# EAGLE design SSTuino_II (EAGLE 9.6.2)

## Sheet 1 of 3
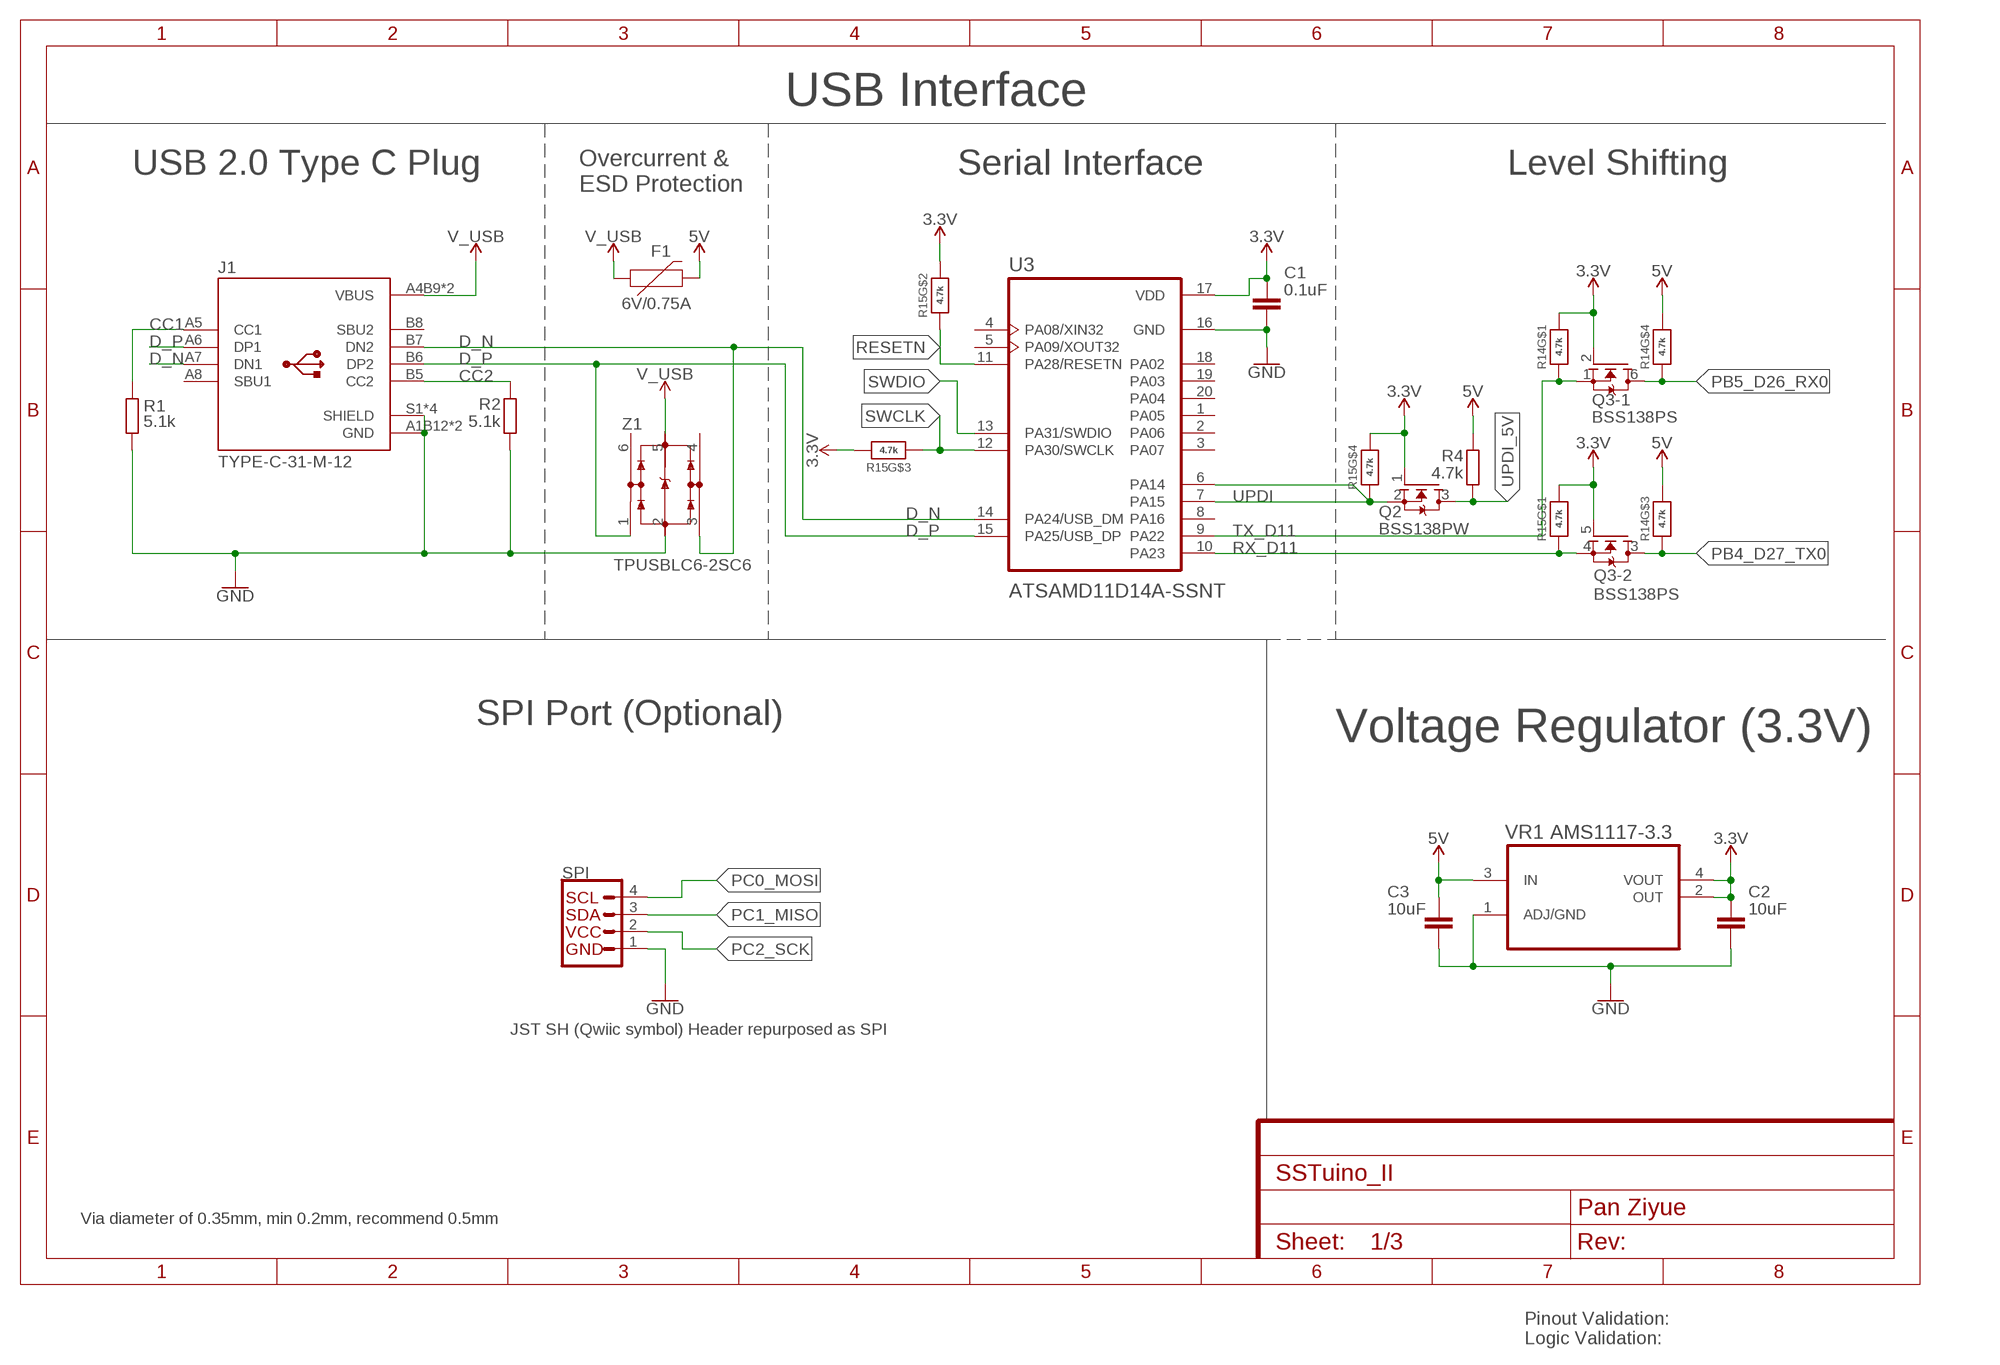
[diagram p0: schematic, sheet 1]
FRAME1 (FRAME-A4L): DESIGNER: Pan Ziyue

### Parts
C1  0.1uF  C_CHIP-0402(1005-METRIC)  [CAPC1005X60]
C2  10uF  C_CHIP-0603(1608-METRIC)  [CAPC1608X85]
C3  10uF  C_CHIP-0603(1608-METRIC)  [CAPC1608X85]
F1  6V/0.75A  PPTC_THREE-QUARTER-AMP  [1206]
J1  TYPE-C-31-M-12  [HRO_TYPE-C-31-M-12]
Q2  BSS138PW  [SOT65P210X110-3N]
Q3  BSS138PS  [ARDUINO-TRANSISTORS_SOT363]
R1  5.1k  R_CHIP-0402(1005-METRIC)  [RESC1005X40]
R2  5.1k  R_CHIP-0402(1005-METRIC)  [RESC1005X40]
R4  4.7k  R_CHIP-0402(1005-METRIC)  [RESC1005X40]
R14  4.7k  RESISTOR_4PACK0402  [RESPACK_4X0402]
R15  4.7k  RESISTOR_4PACK0402  [RESPACK_4X0402]
SPI  QWIIC_CONNECTORJS-1MM  [1X04_1MM_RA]
U3  ATSAMD11D14A-SSNT  [SOIC127P1030X265-20N]
VR1  AMS1117-3.3  LM1117MP-3.3  [SOT230P696X180-4N]
Z1  TPUSBLC6-2SC6  [SOT95P280X110-6N]

### Nets
3.3V: C1.1 C2.1 Q2.1(G) Q3.2(-1:G) Q3.5(-2:G) R14.8 R15.5 R15.6 R15.7 R15.8 U3.17(VDD) VR1.2(OUT) VR1.4(VOUT) ; also sheet 2
5V: C3.1 F1.2 R4.2 R14.5 R14.6 VR1.3(IN) ; also sheet 2
CC1: J1.A5(CC1) R1.1
CC2: J1.B5(CC2) R2.2
D_N [differential]: J1.A7(DN1) J1.B7(DN2) U3.14(PA24/USB_DM) Z1.3(IO2)
D_P [differential]: J1.A6(DP1) J1.B6(DP2) U3.15(PA25/USB_DP) Z1.1(IO1)
GND: C1.2 C2.2 C3.2 J1.A1B12(GND) J1.B1A12(GND) J1.S1(SHIELD) J1.S2(SHIELD) J1.S3(SHIELD) J1.S4(SHIELD) R1.2 R2.1 SPI.1(GND) U3.16(GND) VR1.1(ADJ/GND) Z1.2(VSS) ; also sheet 2
PB4_D27_TX0: Q3.3(-2:D) R14.3 ; also sheet 2
PB5_D26_RX0: Q3.6(-1:D) R14.4 ; also sheet 2
PC0_MOSI: SPI.4(SCL) ; also sheet 2
PC1_MISO: SPI.3(SDA) ; also sheet 2
PC2_SCK: SPI.2(VCC) ; also sheet 2
RESETN: R15.2 U3.11(PA28/RESETN) ; also sheet 2
RX_D11: Q3.4(-2:S) R15.1 U3.10(PA23)
SWCLK: R15.3 U3.12(PA30/SWCLK) ; also sheet 2
SWDIO: U3.13(PA31/SWDIO) ; also sheet 2
TX_D11: Q3.1(-1:S) R14.1 U3.9(PA22)
UPDI: Q2.2(S) R15.4 U3.6(PA14) U3.7(PA15)
UPDI_5V: Q2.3(D) R4.1 ; also sheet 2
V_USB: F1.1 J1.A4B9(VBUS) J1.B4A9(VBUS) Z1.5(VCC)
Unconnected: J1.A8(SBU1) J1.B8(SBU2) R14.2 R14.7 U3.1(PA05) U3.2(PA06) U3.3(PA07) U3.4(PA08/XIN32) U3.5(PA09/XOUT32) U3.8(PA16) U3.18(PA02) U3.19(PA03) U3.20(PA04) Z1.4(IO3) Z1.6(IO4)

### Notes on the sheet
- USB Interface
- USB 2.0 Type C Plug | Serial Interface | Level Shifting
- Overcurrent &
  ESD Protection
- SPI Port (Optional)
- Voltage Regulator (3.3V)
- JST SH (Qwiic symbol) Header repurposed as SPI
- Via diameter of 0.35mm, min 0.2mm, recommend 0.5mm
- Pinout Validation: 
  Logic Validation:

## Sheet 2 of 3
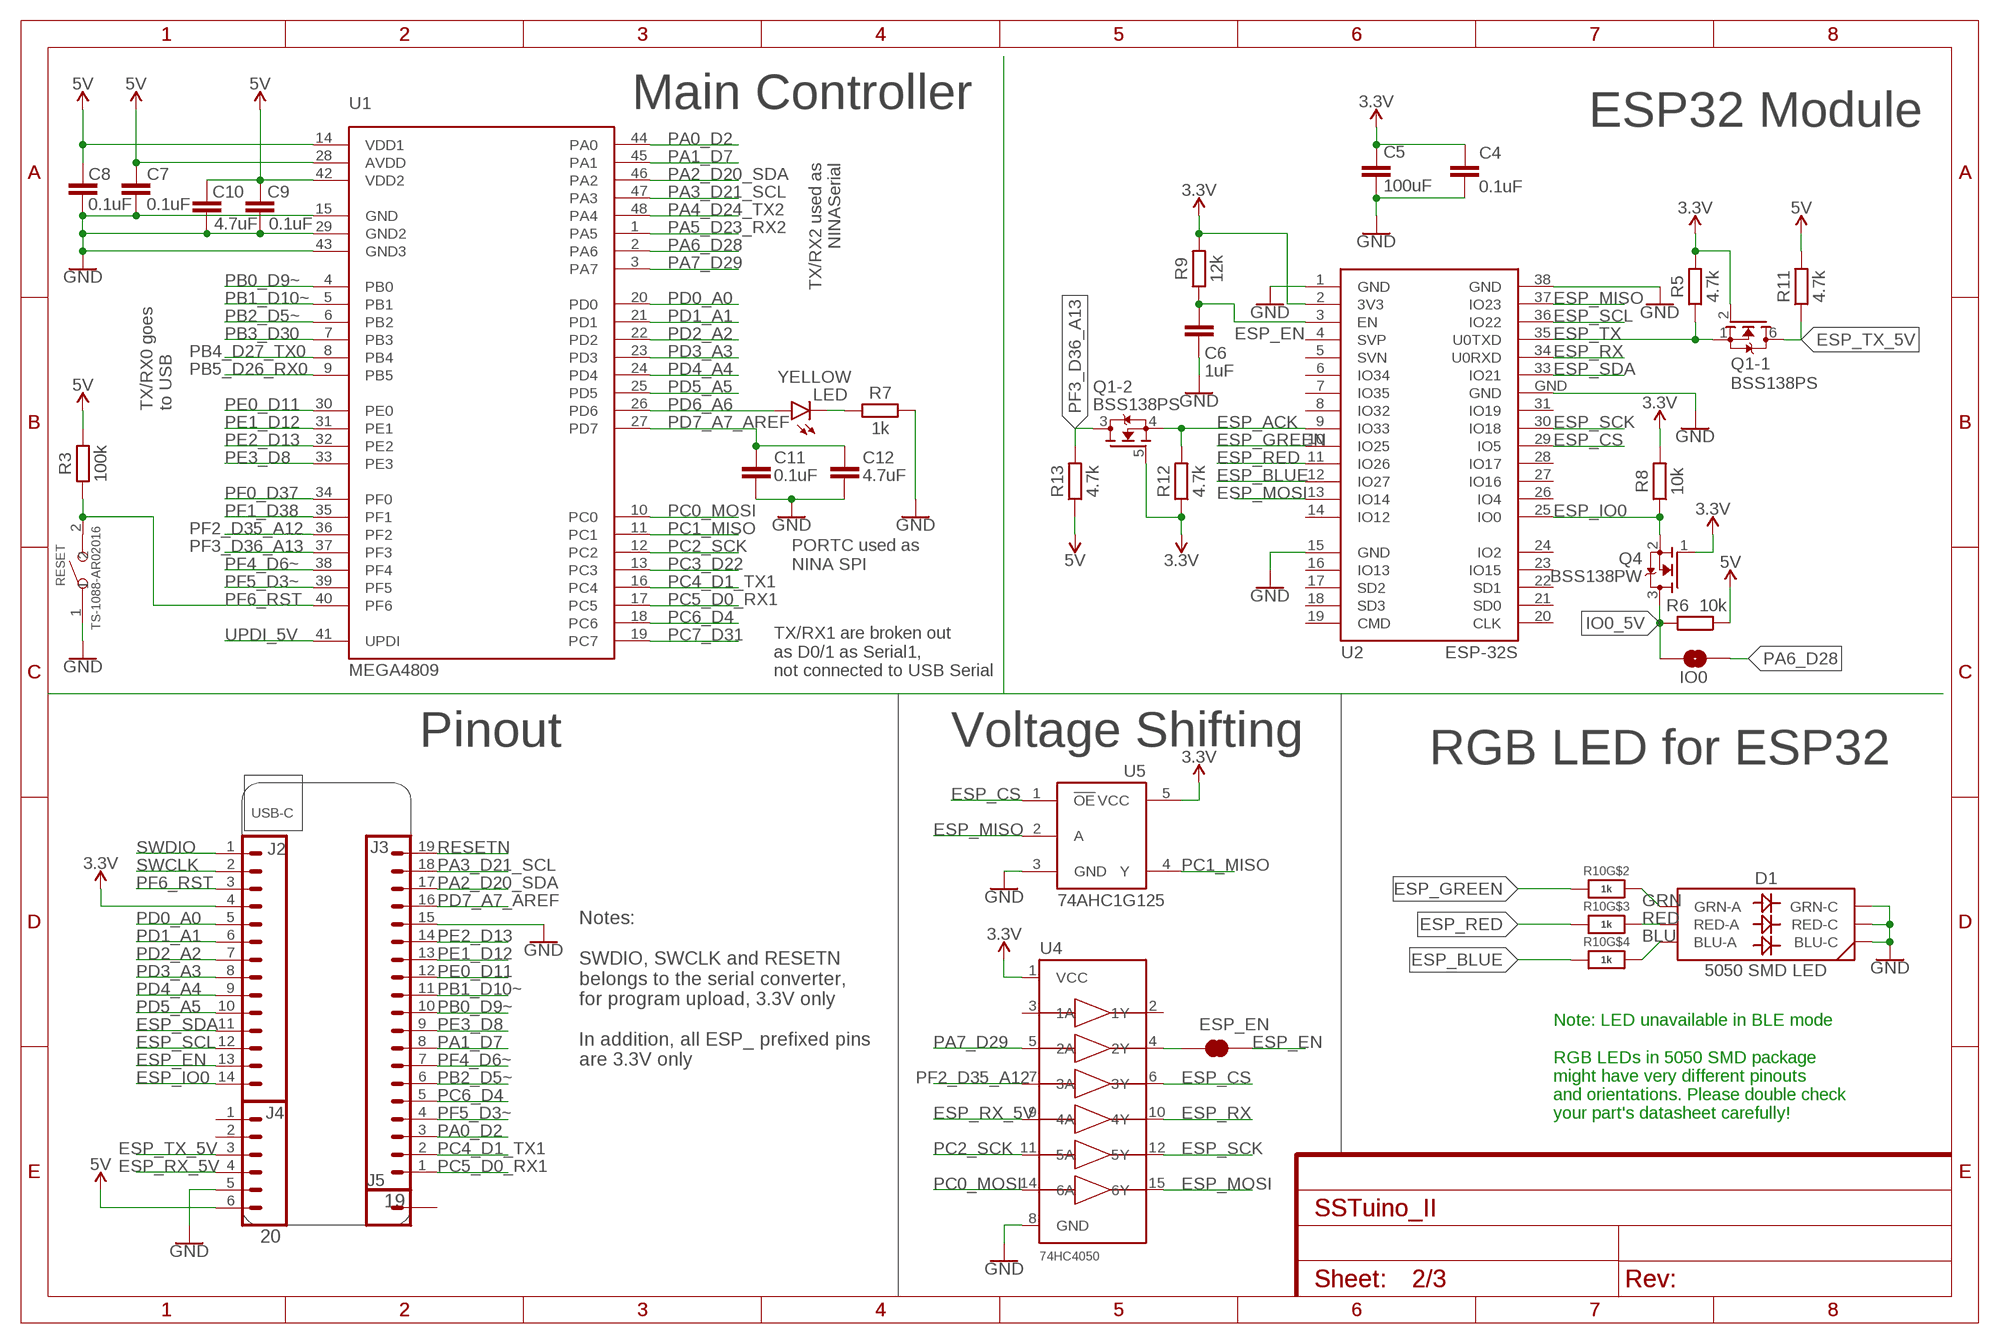
[diagram p1: schematic, sheet 2]

### Parts
C4  0.1uF  C_CHIP-0402(1005-METRIC)  [CAPC1005X60]
C5  100uF  C_CHIP-1206(3216-METRIC)  [CAPC3216X135]
C6  1uF  C_CHIP-0402(1005-METRIC)  [CAPC1005X60]
C7  0.1uF  C_CHIP-0402(1005-METRIC)  [CAPC1005X60]
C8  0.1uF  C_CHIP-0402(1005-METRIC)  [CAPC1005X60]
C9  0.1uF  C_CHIP-0402(1005-METRIC)  [CAPC1005X60]
C10  4.7uF  C_CHIP-0402(1005-METRIC)  [CAPC1005X60]
C11  0.1uF  C_CHIP-0402(1005-METRIC)  [CAPC1005X60]
C12  4.7uF  C_CHIP-0402(1005-METRIC)  [CAPC1005X60]
D1  5050 SMD LED  LED-RGBTC5050RGBF08  [LED-TRICOLOR-5050]
ESP_EN  JUMPER-SMT_2_NC_TRACE_SILK  [SMT-JUMPER_2_NC_TRACE_SILK]
IO0  JUMPER-SMT_2_NO_SILK  [SMT-JUMPER_2_NO_SILK]
J2  CONN_14NO_SILK  [1X14_NO_SILK]
J3  CONN_191X19_NO_SILK  [1X19_NO_SILK]
J4  CONN_06NO_SILK_FEMALE_PTH  [1X06_NO_SILK]
J5  CONN_01PTH_NO_SILK_YES_STOP  [1X01_NO_SILK]
LED  YELLOW  LED0603  [LED-0603]
Q1  BSS138PS  [ARDUINO-TRANSISTORS_SOT363]
Q4  BSS138PW  [SOT65P210X110-3N]
R3  100k  R_CHIP-0402(1005-METRIC)  [RESC1005X40]
R5  4.7k  R_CHIP-0402(1005-METRIC)  [RESC1005X40]
R6  10k  R_CHIP-0402(1005-METRIC)  [RESC1005X40]
R7  1k  R_CHIP-0402(1005-METRIC)  [RESC1005X40]
R8  10k  R_CHIP-0402(1005-METRIC)  [RESC1005X40]
R9  12k  R_CHIP-0402(1005-METRIC)  [RESC1005X40]
R10  1k  RESISTOR_4PACK0402  [RESPACK_4X0402]
R11  4.7k  R_CHIP-0402(1005-METRIC)  [RESC1005X40]
R12  4.7k  R_CHIP-0402(1005-METRIC)  [RESC1005X40]
R13  4.7k  R_CHIP-0402(1005-METRIC)  [RESC1005X40]
RESET  TS-1088-AR02016  SMD-BUTTON(2P-3.9X2.9X1.5+0.4MM)-SKRKAEE020  [SW2-2.6-3.9X2.9X1.5+0.4MM]
U1  MEGA4809  [TQFP48]
U2  ESP-32S  [ESP-32S]
U4  74HC4050  74HC4050DTSSOP  [TSSOP16]
U5  74AHC1G125  [SOT23-5L]

### Nets
3.3V: C4.1 C5.1 J2.4 Q1.2(-1:G) Q1.5(-2:G) Q4.1(G) R5.2 R8.2 R9.2 R12.1 U2.2(3V3) U4.1(VCC) U5.5(VCC) ; also sheet 1
5V: C7.1 C8.1 C9.1 C10.1 J4.6 R3.2 R6.1 R11.2 R13.1 U1.14(VDD1) U1.28(AVDD) U1.42(VDD2) ; also sheet 1
BLU: D1.6(BLU-A) R10.5
ESP_ACK: Q1.4(-2:S) R12.2 U2.9(IO33)
ESP_BLUE: R10.4 U2.12(IO27)
ESP_CS: U2.29(IO5) U4.6(3Y) U5.1(!OE)
ESP_EN: C6.2 ESP_EN.2 J2.13 R9.1 U2.3(EN)
ESP_EN_PRE: ESP_EN.1 U4.4(2Y)
ESP_GREEN: R10.2 U2.10(IO25)
ESP_IO0: J2.14 Q4.2(S) R8.1 U2.25(IO0)
ESP_MISO: U2.37(IO23) U5.2(A)
ESP_MOSI: U2.13(IO14) U4.15(6Y)
ESP_RED: R10.3 U2.11(IO26)
ESP_RX: U2.34(U0RXD) U4.10(4Y)
ESP_RX_5V: J4.4 U4.9(4A)
ESP_SCK: U2.30(IO18) U4.12(5Y)
ESP_SCL: J2.12 U2.36(IO22)
ESP_SDA: J2.11 U2.33(IO21)
ESP_TX: Q1.1(-1:S) R5.1 U2.35(U0TXD)
ESP_TX_5V: J4.3 Q1.6(-1:D) R11.1
GND: C4.2 C5.2 C6.1 C7.2 C8.2 C9.2 C10.2 C11.2 C12.2 D1.1(BLU-C) D1.2(RED-C) D1.3(GRN-C) J3.15 J4.5 R7.2 RESET.1 U1.15(GND) U1.29(GND2) U1.43(GND3) U2.1(GND) U2.15(GND) U2.38(GND) U2.GND U4.8(GND) U5.3(GND) ; also sheet 1
GRN: D1.4(GRN-A) R10.7
IO0_5V: IO0.2 Q4.3(D) R6.2
N$2: LED.C R7.1
PA0_D2: J3.3 U1.44(PA0)
PA1_D7: J3.8 U1.45(PA1)
PA2_D20_SDA: J3.17 U1.46(PA2)
PA3_D21_SCL: J3.18 U1.47(PA3)
PA4_D24_TX2: U1.48(PA4)
PA5_D23_RX2: U1.1(PA5)
PA6_D28: IO0.1 U1.2(PA6)
PA7_D29: U1.3(PA7) U4.5(2A)
PB0_D9~: J3.10 U1.4(PB0)
PB1_D10~: J3.11 U1.5(PB1)
PB2_D5~: J3.6 U1.6(PB2)
PB3_D30: U1.7(PB3)
PB4_D27_TX0: U1.8(PB4) ; also sheet 1
PB5_D26_RX0: U1.9(PB5) ; also sheet 1
PC0_MOSI: U1.10(PC0) U4.14(6A) ; also sheet 1
PC1_MISO: U1.11(PC1) U5.4(Y) ; also sheet 1
PC2_SCK: U1.12(PC2) U4.11(5A) ; also sheet 1
PC3_D22: U1.13(PC3)
PC4_D1_TX1: J3.2 U1.16(PC4)
PC5_D0_RX1: J3.1 U1.17(PC5)
PC6_D4: J3.5 U1.18(PC6)
PC7_D31: U1.19(PC7)
PD0_A0: J2.5 U1.20(PD0)
PD1_A1: J2.6 U1.21(PD1)
PD2_A2: J2.7 U1.22(PD2)
PD3_A3: J2.8 U1.23(PD3)
PD4_A4: J2.9 U1.24(PD4)
PD5_A5: J2.10 U1.25(PD5)
PD6_A6: LED.A U1.26(PD6)
PD7_A7_AREF: C11.1 C12.1 J3.16 U1.27(PD7)
PE0_D11: J3.12 U1.30(PE0)
PE1_D12: J3.13 U1.31(PE1)
PE2_D13: J3.14 U1.32(PE2)
PE3_D8: J3.9 U1.33(PE3)
PF0_D37: U1.34(PF0)
PF1_D38: U1.35(PF1)
PF2_D35_A12: U1.36(PF2) U4.7(3A)
PF3_D36_A13: Q1.3(-2:D) R13.2 U1.37(PF3)
PF4_D6~: J3.7 U1.38(PF4)
PF5_D3~: J3.4 U1.39(PF5)
PF6_RST: J2.3 R3.1 RESET.2 U1.40(PF6)
RED: D1.5(RED-A) R10.6
RESETN: J3.19 ; also sheet 1
SWCLK: J2.2 ; also sheet 1
SWDIO: J2.1 ; also sheet 1
UPDI_5V: U1.41(UPDI) ; also sheet 1
Unconnected: J4.1 J4.2 J5.1 R10.1 R10.8 U2.4(SVP) U2.5(SVN) U2.6(IO34) U2.7(IO35) U2.8(IO32) U2.14(IO12) U2.16(IO13) U2.17(SD2) U2.18(SD3) U2.19(CMD) U2.20(CLK) U2.21(SD0) U2.22(SD1) U2.23(IO15) U2.24(IO2) U2.26(IO4) U2.27(IO16) U2.28(IO17) U2.31(IO19) U4.2(1Y) U4.3(1A)

### Notes on the sheet
- Main Controller
- ESP32 Module
- TX/RX2 used as
  NINASerial
- TX/RX0 goes
  to USB
- PORTC used as
  NINA SPI
- TX/RX1 are broken out 
  as D0/1 as Serial1,
  not connected to USB Serial
- Pinout | Voltage Shifting
- RGB LED for ESP32
- USB-C
- Notes:
  
  SWDIO, SWCLK and RESETN 
  belongs to the serial converter, 
  for program upload, 3.3V only
  
  In addition, all ESP_ prefixed pins
  are 3.3V only
- Note: LED unavailable in BLE mode
  
  RGB LEDs in 5050 SMD package
  might have very different pinouts
  and orientations. Please double check
  your part's datasheet carefully!
- 19
- 20

## Sheet 3 of 3
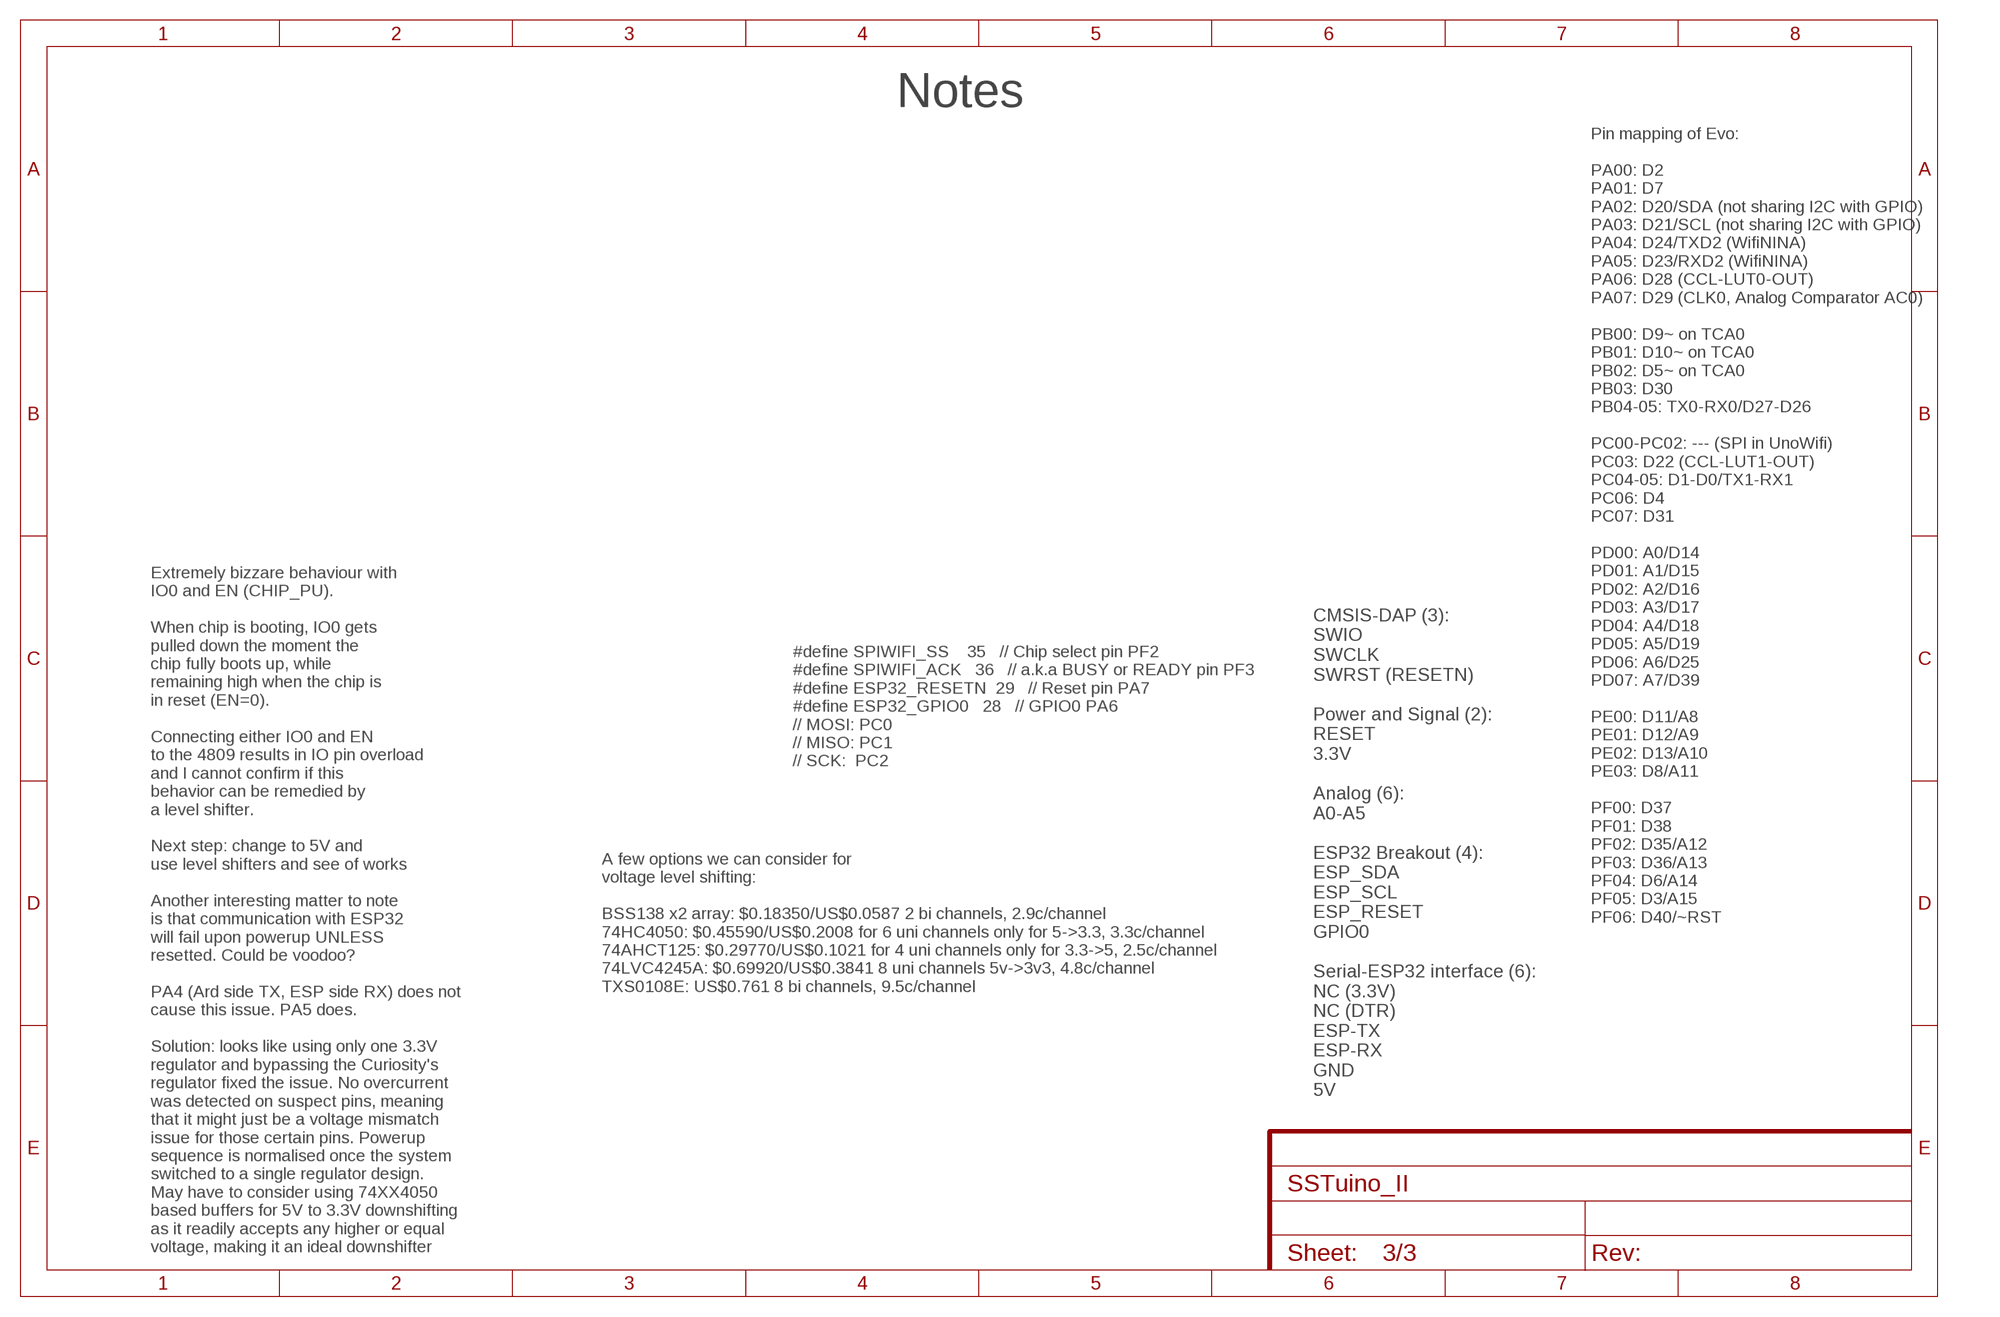
[diagram p2: schematic, sheet 3]

### Notes on the sheet
- Notes
- #define SPIWIFI_SS    35   // Chip select pin PF2
  #define SPIWIFI_ACK   36   // a.k.a BUSY or READY pin PF3
  #define ESP32_RESETN  29   // Reset pin PA7
  #define ESP32_GPIO0   28   // GPIO0 PA6
  // MOSI: PC0
  // MISO: PC1
  // SCK:  PC2
- Pin mapping of Evo:
  
  PA00: D2
  PA01: D7
  PA02: D20/SDA (not sharing I2C with GPIO)
  PA03: D21/SCL (not sharing I2C with GPIO)
  PA04: D24/TXD2 (WifiNINA)
  PA05: D23/RXD2 (WifiNINA)
  PA06: D28 (CCL-LUT0-OUT)
  PA07: D29 (CLK0, Analog Comparator AC0)
  
  PB00: D9~ on TCA0
  PB01: D10~ on TCA0
  PB02: D5~ on TCA0
  PB03: D30
  PB04-05: TX0-RX0/D27-D26
  
  PC00-PC02: --- (SPI in UnoWifi)
  PC03: D22 (CCL-LUT1-OUT)
  PC04-05: D1-D0/TX1-RX1
  PC06: D4
  PC07: D31
  
  PD00: A0/D14
  PD01: A1/D15
  PD02: A2/D16
  PD03: A3/D17
  PD04: A4/D18
  PD05: A5/D19
  PD06: A6/D25
  PD07: A7/D39
  
  PE00: D11/A8
  PE01: D12/A9
  PE02: D13/A10
  PE03: D8/A11
  
  PF00: D37
  PF01: D38
  PF02: D35/A12
  PF03: D36/A13
  PF04: D6/A14
  PF05: D3/A15
  PF06: D40/~RST
- A few options we can consider for
  voltage level shifting:
  
  BSS138 x2 array: $0.18350/US$0.0587 2 bi channels, 2.9c/channel
  74HC4050: $0.45590/US$0.2008 for 6 uni channels only for 5->3.3, 3.3c/channel
  74AHCT125: $0.29770/US$0.1021 for 4 uni channels only for 3.3->5, 2.5c/channel
  74LVC4245A: $0.69920/US$0.3841 8 uni channels 5v->3v3, 4.8c/channel
  TXS0108E: US$0.761 8 bi channels, 9.5c/channel
- CMSIS-DAP (3):
  SWIO
  SWCLK
  SWRST (RESETN)
  
  Power and Signal (2):
  RESET
  3.3V
  
  Analog (6):
  A0-A5
  
  ESP32 Breakout (4):
  ESP_SDA
  ESP_SCL
  ESP_RESET
  GPIO0
  
  Serial-ESP32 interface (6):
  NC (3.3V)
  NC (DTR)
  ESP-TX
  ESP-RX
  GND
  5V
- Extremely bizzare behaviour with
  IO0 and EN (CHIP_PU). 
  
  When chip is booting, IO0 gets 
  pulled down the moment the 
  chip fully boots up, while 
  remaining high when the chip is
  in reset (EN=0).
  
  Connecting either IO0 and EN
  to the 4809 results in IO pin overload
  and I cannot confirm if this
  behavior can be remedied by
  a level shifter. 
  
  Next step: change to 5V and
  use level shifters and see of works
  
  Another interesting matter to note
  is that communication with ESP32
  will fail upon powerup UNLESS
  resetted. Could be voodoo?
  
  PA4 (Ard side TX, ESP side RX) does not
  cause this issue. PA5 does.
  
  Solution: looks like using only one 3.3V 
  regulator and bypassing the Curiosity's
  regulator fixed the issue. No overcurrent
  was detected on suspect pins, meaning
  that it might just be a voltage mismatch
  issue for those certain pins. Powerup
  sequence is normalised once the system
  switched to a single regulator design.
  May have to consider using 74XX4050
  based buffers for 5V to 3.3V downshifting
  as it readily accepts any higher or equal
  voltage, making it an ideal downshifter

## Library data of the parts
C1 = Capacitor:C: Capacitor - Generic; CATEGORY: Capacitor; LCSC_PART: C696352
C2 C3 = Capacitor:C: Capacitor - Generic; CATEGORY: Capacitor; LCSC_PART: C19702
C4 C11 = Capacitor:C: Capacitor - Generic; CATEGORY: Capacitor; LCSC_PART: C1525
C5 = Capacitor:C: Capacitor - Generic; CATEGORY: Capacitor; LCSC_PART: C15008
C6 = Capacitor:C: Capacitor - Generic; CATEGORY: Capacitor; LCSC_PART: C52923
C7-C10 = Capacitor:C: Capacitor - Generic; CATEGORY: Capacitor
C12 = Capacitor:C: Capacitor - Generic; CATEGORY: Capacitor; LCSC_PART: C23733
D1 = D3ltav's Custom:LED-RGB: LED-RGB 6 pin RGB LED (no common connector) Warning: please check and double check your pinout vs. the datasheet! 5050 SMD LEDs are commonly packaged in all sorts of weird, non-standard pinouts. This footprint and symbol is only applicable to the LED mentioned below Packages: LED-TRICOLOR-5050 - Based on TC5050RGBF08 RGB LED <https://datasheet.lcsc.com/szlcsc/2009231707_TCWIN-TC5050RGBF08-3CJH-AF53A_C784540.pdf>; LCSC_PART: C784540; PROD_ID: DIO-10298
ESP_EN = SparkFun-Jumpers:JUMPER-SMT_2_NC_TRACE: Normally closed trace jumper This jumper has a trace between two pads so it's normally closed (NC). Use a razor knife to open the connection. For best results follow the IPC guidelines for cutting traces: Cutout at least 0.063 mm (0.005 in). Remove all loose material to clean up the cut area. Seal the cut with an approved epoxy. Reapply solder to reclose the connection.
F1 = SparkFun-Fuses:PPTC: Resettable Fuse PPTC Resettable Fuse. Really a sort of resistor with a polymeric positive temperature coefficient whose resistance increases dramatically with an increase in temperature. When heated by the power passing through the resistance rises causing the current to be limited, protecting the circuit. This is achieved by the transition of the polymer from a crystalline to an amorphous state where the conductive carbon separates breaking the conductive pathways found in the cool crystalline structure. When a PPTC cools back down it resumes conducting letting the circuit turn back on. SparkFun Products: SparkFun RedBoard - Programmed with Arduino <https://www.sparkfun.com/products/12757> Pro Micro - 5V/16MHz <https://www.sparkfun.com/products/12640> Arduino Pro 328 - 5V/16MHz <https://www.sparkfun.com/products/10915> MP3 Trigger <https://www.sparkfun.com/products/13720>; LCSC_PART: C99563; PROD_ID: RES-11150
IO0 = SparkFun-Jumpers:JUMPER-SMT_2_NO: Normally open jumper This jumper has two pads in close proximity to each other. Apply solder to close the connection. Round pads are easier to solder for beginners, but are a lot larger. SparkFun Product that uses the round pads: SparkFun EL Sequencer <https://www.sparkfun.com/products/12781>
J1 = D3ltav's Custom:TYPE-C-31-M-12: USB Connectors 24 Receptacle 1 8.94*7.3mm RoHS Check prices <https://pricing.snapeda.com/parts/TYPE-C-31-M-12/HRO%20Electronics%20Co.%2C%20Ltd./view-part?ref=eda>; AVAILABILITY: No availability data; DESCRIPTION: USB Connectors 24 Receptacle 1 8.94*7.3mm RoHS; LCSC_PART: C165948; MF: HRO Electronics Co., Ltd.; MP: TYPE-C-31-M-12; PACKAGE: Package; PRICE: None
J2 = SparkFun-Connectors:CONN_14: Multi connection point. Often used as Generic Header-pin footprint for 0.1 inch spaced/style header connections On any of the 0.1 inch spaced packages, you can populate with these: Break Away Headers - Straight <https://www.sparkfun.com/products/116> (PRT-00116) Break Away Male Headers - Right Angle <https://www.sparkfun.com/products/553> (PRT-00553) Female Headers <https://www.sparkfun.com/products/115> (PRT-00115) Break Away Headers - Machine Pin <https://www.sparkfun.com/products/117> (PRT-00117) Break Away Female Headers - Swiss Machine Pin <https://www.sparkfun.com/products/743> (PRT-00743) For SCREWTERMINALS and SPRING TERMINALS visit here: Screw Terimnals on SparkFun.com <https://www.sparkfun.com/search/results?term=Screw+Terminals> (5mm/3.5mm/2.54mm spacing) This device is also useful as a general connection point to wire up your design to another part of your project. Our various solder wires solder well into these plated through hole pads. Hook-Up Wire - Assortment (Stranded, 22 AWG) <https://www.sparkfun.com/products/11375> (PRT-11375) Hook-Up Wire - Assortment (Solid Core, 22 AWG) <https://www.sparkfun.com/products/11367> (PRT-11367) View the entire wire category on our website here <https://www.sparkfun.com/categories/141> Special notes: Molex polarized connector foot print use with SKU : PRT-08231 with associated crimp pins and housings. 1MM SMD Version SKU: PRT-10208 NOTES ON THE VARIANTS LOCK and LOCK_LONGPADS... This footprint was designed to help hold the alignment of a through-hole component (i.e. 6-pin header) while soldering it into place. You may notice that each hole has been shifted either up or down by 0.005 of an inch from it's more standard position (which is a perfectly straight line). This slight alteration caused the pins (the squares in the middle) to touch the edges of the holes. Because they are alternating, it causes a "brace" to hold the component in place. 0.005 has proven to be the perfect amount of "off-center" position when using our standard breakaway headers. Although looks a little odd when you look at the bare footprint, once you have a header in there, the alteration is very hard to notice. Also,if you push a header all the way into place, it is covered up entirely on the bottom side.
J3 = SparkFun-Connectors:CONN_19: Multi connection point. Often used as Generic Header-pin footprint for 0.1 inch spaced/style header connections On any of the 0.1 inch spaced packages, you can populate with these: Break Away Headers - Straight <https://www.sparkfun.com/products/116> (PRT-00116) Break Away Male Headers - Right Angle <https://www.sparkfun.com/products/553> (PRT-00553) Female Headers <https://www.sparkfun.com/products/115> (PRT-00115) Break Away Headers - Machine Pin <https://www.sparkfun.com/products/117> (PRT-00117) Break Away Female Headers - Swiss Machine Pin <https://www.sparkfun.com/products/743> (PRT-00743) For SCREWTERMINALS and SPRING TERMINALS visit here: Screw Terimnals on SparkFun.com <https://www.sparkfun.com/search/results?term=Screw+Terminals> (5mm/3.5mm/2.54mm spacing) This device is also useful as a general connection point to wire up your design to another part of your project. Our various solder wires solder well into these plated through hole pads. Hook-Up Wire - Assortment (Stranded, 22 AWG) <https://www.sparkfun.com/products/11375> (PRT-11375) Hook-Up Wire - Assortment (Solid Core, 22 AWG) <https://www.sparkfun.com/products/11367> (PRT-11367) View the entire wire category on our website here <https://www.sparkfun.com/categories/141> Special notes: Molex polarized connector foot print use with SKU : PRT-08231 with associated crimp pins and housings. 1MM SMD Version SKU: PRT-10208 NOTES ON THE VARIANTS LOCK and LOCK_LONGPADS... This footprint was designed to help hold the alignment of a through-hole component (i.e. 6-pin header) while soldering it into place. You may notice that each hole has been shifted either up or down by 0.005 of an inch from it's more standard position (which is a perfectly straight line). This slight alteration caused the pins (the squares in the middle) to touch the edges of the holes. Because they are alternating, it causes a "brace" to hold the component in place. 0.005 has proven to be the perfect amount of "off-center" position when using our standard breakaway headers. Although looks a little odd when you look at the bare footprint, once you have a header in there, the alteration is very hard to notice. Also,if you push a header all the way into place, it is covered up entirely on the bottom side.
J4 = SparkFun-Connectors:CONN_06: Multi connection point. Often used as Generic Header-pin footprint for 0.1 inch spaced/style header connections On any of the 0.1 inch spaced packages, you can populate with these: Break Away Headers - Straight <https://www.sparkfun.com/products/116> (PRT-00116) Break Away Male Headers - Right Angle <https://www.sparkfun.com/products/553> (PRT-00553) Female Headers <https://www.sparkfun.com/products/115> (PRT-00115) Break Away Headers - Machine Pin <https://www.sparkfun.com/products/117> (PRT-00117) Break Away Female Headers - Swiss Machine Pin <https://www.sparkfun.com/products/743> (PRT-00743) Arduino Stackable Header - 6 Pin <https://www.sparkfun.com/products/9280> (PRT-09280) For SCREWTERMINALS and SPRING TERMINALS visit here: Screw Terimnals on SparkFun.com <https://www.sparkfun.com/search/results?term=Screw+Terminals> (5mm/3.5mm/2.54mm spacing) This device is also useful as a general connection point to wire up your design to another part of your project. Our various solder wires solder well into these plated through hole pads. Hook-Up Wire - Assortment (Stranded, 22 AWG) <https://www.sparkfun.com/products/11375> (PRT-11375) Hook-Up Wire - Assortment (Solid Core, 22 AWG) <https://www.sparkfun.com/products/11367> (PRT-11367) View the entire wire category on our website here <https://www.sparkfun.com/categories/141>; PROD_ID: CONN-08437
J5 = SparkFun-Connectors:CONN_01: Single connection point. Often used as Generic Header-pin footprint for 0.1 inch spaced/style header connections On any of the 0.1 inch spaced packages, you can populate with these: Break Away Headers - Straight <https://www.sparkfun.com/products/116> (PRT-00116) Break Away Male Headers - Right Angle <https://www.sparkfun.com/products/553> (PRT-00553) Female Headers <https://www.sparkfun.com/products/115> (PRT-00115) Break Away Headers - Machine Pin <https://www.sparkfun.com/products/117> (PRT-00117) Break Away Female Headers - Swiss Machine Pin <https://www.sparkfun.com/products/743> (PRT-00743) This device is also useful as a general connection point to wire up your design to another part of your project. Our various solder wires solder well into these plated through hole pads. Hook-Up Wire - Assortment (Stranded, 22 AWG) <https://www.sparkfun.com/products/11375> (PRT-11375) Hook-Up Wire - Assortment (Solid Core, 22 AWG) <https://www.sparkfun.com/products/11367> (PRT-11367) View the entire wire category on our website here <https://www.sparkfun.com/categories/141> Special notes: SMTSO-256-ET is a "flush mount" nut for a 4-40 screw. We mostly use this on specialty testbeds; it is a nice way to connect hardware to your PCB at an adjustable hieght. Also note, the SNAP packages are for using a snappable style connector. We sell a baggie of snaps and they are also used on two LilyPad designs: Snap Assortment - 30 pack (male and female) <https://www.sparkfun.com/products/11347> (DEV-11347) LilyPad Arduino SimpleSnap <https://www.sparkfun.com/products/10941> (DEV-10941) LilyPad SimpleSnap Protoboard <https://www.sparkfun.com/products/10940> (DEV-10940)
LED = SparkFun-LED:LED: LED (Generic) Standard schematic elements and footprints for 5mm, 3mm, 1206, and 0603 sized LEDs. Generic LEDs with no color specified.; LCSC_PART: C72038
Q1 Q3 = D3ltav's Custom:BSS138PS: MOSFET 2N-CH 60V 0.32A 6TSSOP; CODE-ARDUINO: 2323; DATASHEET: https://assets.nexperia.com/documents/data-sheet/BSS138PS.pdf; DISTRIBUTOR-LINK: http://www.digikey.com/product-detail/en/nxp-semiconductors/BSS138PS,115/568-8393-1-ND/2763927; DISTRIBUTOR-PN: 568-8393-1-ND; LCSC_PART: C193381; MANUFACTURER: NXP; MANUFACTURER-PN: BSS138PS,115
Q2 = D3ltav's Custom:BSS138PW: N-channel Trench MOSFET Check prices <https://pricing.snapeda.com/parts/BSS138PW/NXP%20Semiconductors/view-part?ref=eda>; AVAILABILITY: In Stock; DESCRIPTION: N-Channel 60V 320mA (Ta) 260mW (Ta), 830mW (Tc) Surface Mount SC-70; LCSC_PART: C193366; MF: NXP Semiconductors; MP: BSS138PW; PACKAGE: SC-70 NXP Semiconductors; PRICE: None
Q4 = D3ltav's Custom:BSS138PW: N-channel Trench MOSFET Check prices <https://pricing.snapeda.com/parts/BSS138PW/NXP%20Semiconductors/view-part?ref=eda>; AVAILABILITY: In Stock; DESCRIPTION: N-Channel 60V 320mA (Ta) 260mW (Ta), 830mW (Tc) Surface Mount SC-70; LCSC_PART: C919583; MF: NXP Semiconductors; MP: BSS138PW; PACKAGE: SC-70 NXP Semiconductors; PRICE: None
R1 R2 = Resistor:R: Resistor Fixed - Generic; CATEGORY: Resistor; LCSC_PART: C25905; SUB-CATEGORY: Fixed
R3 = Resistor:R: Resistor Fixed - Generic; CATEGORY: Resistor; LCSC_PART: C25741; SUB-CATEGORY: Fixed
R4 R5 R11-R13 = Resistor:R: Resistor Fixed - Generic; CATEGORY: Resistor; LCSC_PART: C25900; SUB-CATEGORY: Fixed
R6 R8 = Resistor:R: Resistor Fixed - Generic; CATEGORY: Resistor; LCSC_PART: C25744; SUB-CATEGORY: Fixed
R7 = Resistor:R: Resistor Fixed - Generic; CATEGORY: Resistor; LCSC_PART: C11702; SUB-CATEGORY: Fixed
R9 = Resistor:R: Resistor Fixed - Generic; CATEGORY: Resistor; LCSC_PART: C25752; SUB-CATEGORY: Fixed
R10 = D3ltav's Custom:RESISTOR_4PACK: Resistor Packs (4 resistors) 4 x 0603 10K 1/16W - Digikey: YC164J-10KCT-ND; LCSC_PART: C25726
R14 R15 = D3ltav's Custom:RESISTOR_4PACK: Resistor Packs (4 resistors) 4 x 0603 10K 1/16W - Digikey: YC164J-10KCT-ND; LCSC_PART: C29586
RESET = D3ltav's Custom:SMD-BUTTON(2P-3.9X2.9X1.5+0.4MM): 311020047; LCSC_PART: C720477; MPN: SKRKAEE020; VALUE: SKRKAEE020
SPI = SparkFun-Connectors:QWIIC_CONNECTOR: SparkFun I2C Standard Qwiic Connector An SMD 1mm pitch JST connector makes it easy and quick (get it? Qwiic?) to connect I2C devices to each other. The Qwiic system <http://www.sparkfun.com/qwiic> enables fast and solderless connection between popular platforms and various sensors and actuators. We carry 200mm <https://www.sparkfun.com/products/14204>, 100mm <https://www.sparkfun.com/products/14205>, 50mm <https://www.sparkfun.com/products/14206>, and breadboard friendly <https://www.sparkfun.com/products/14207> Qwiic cables. We also offer 10 pcs strips <https://www.sparkfun.com/products/14323> the SMD connectors.
U1 = microwavemont_ATMEGA4809:MEGA4809; LCSC_PART: C189475
U2 = esp32:ESP-32S: Ai-Thinker ESP-32S; LCSC_PART: C277944
U3 = D3ltav's Custom:ATSAMD11D14A-SSNT; AVAILABILITY: In Stock; DESCRIPTION: ARM® Cortex®-M0+ SAM D11D Microcontroller IC 32-Bit 48MHz 16KB (16K x 8) FLASH 20-SOIC; LCSC_PART: C2053599; MF: Microchip; MP: ATSAMD11D14A-SSNT; PACKAGE: SOIC-20 Microchip; PRICE: None
U4 = D3ltav's Custom:74HC4050D: 6-channel level shifter 74HC4050D - 2V-6V Supply SOIC16 Digikey: 74HC4050D,653-ND Mouser: 771-74HC4050D-T TSSOP16 Digikey: 296-9215-1-ND Mouser:; LCSC_PART: C352825
U5 = adafruit:74AHC1G125; LCSC_PART: C7468
VR1 = D3ltav's Custom:LM1117MP-3.3: Linear regulators; LCSC_PART: C6186; MPN: LM1117MP-3.3; OC_FARNELL: 9778195; OC_NEWARK: 41K3470; PACKAGE: SOT223-3; SUPPLIER: NationalSemiconductor
Z1 = D3ltav's Custom:TPUSBLC6-2SC6: TPUSBLC6-2SC6 Low Capacitance 2-Line ESD Protection www.sot23.com.tw; LCSC_PART: C558442

## Net classes
0 default: width 0.203 mm, drill 0.35 mm
1 differential: width 0.254 mm

## Board
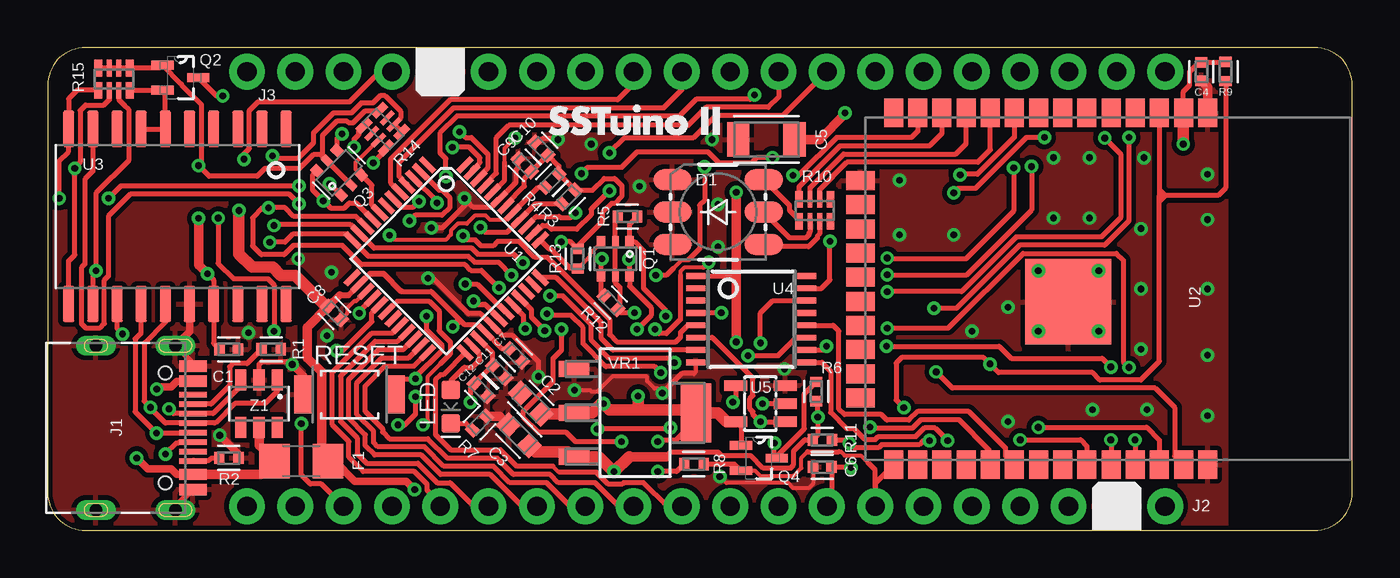
[diagram p3: board, top side]
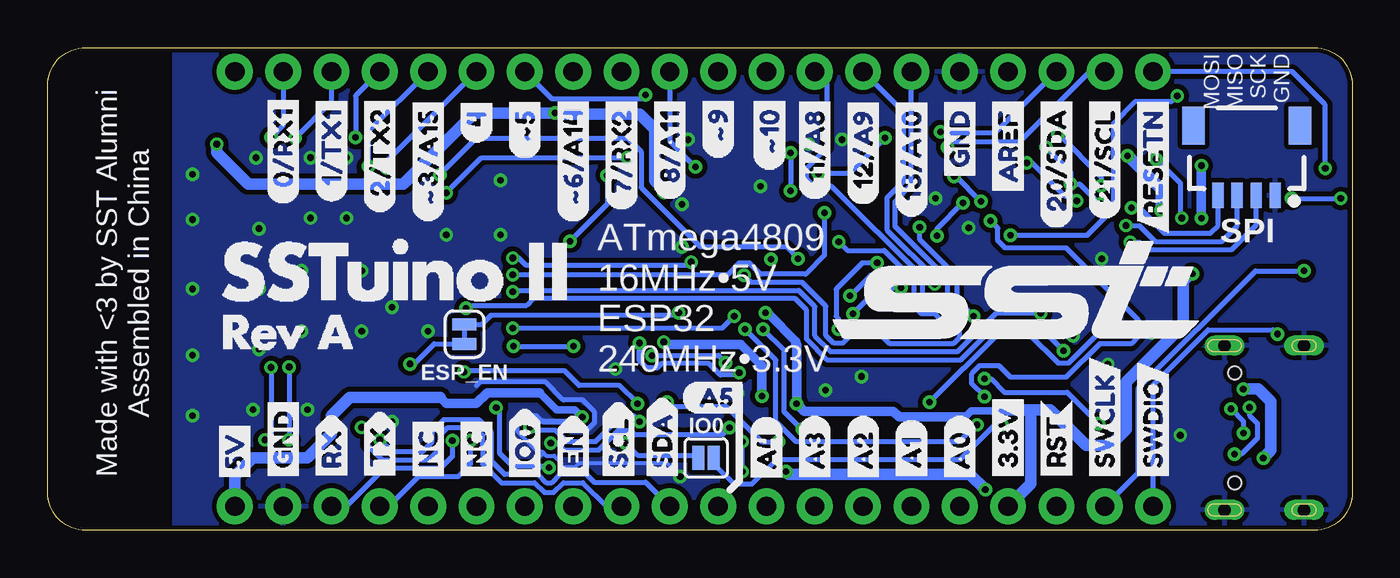
[diagram p4: board, bottom side, seen from below]

Size 68.58 x 25.4 mm. Coordinates in mm from the lower left corner, seen from the top.
Outline: 2,0 66.58,0 arc90 68.58,2 68.58,23.4 arc90 66.58,25.4 2,25.4 arc90 0,23.4 0,2 arc90 2,0
Copper layers (1*16): Top 0.035mm / dielectric 1.5mm / Bottom 0.035mm
Design rules "SparkFun-2-Layer-General-JLCPCB": minimum track width 7mil, minimum drill 0.3mm, track to track 7mil, track to pad 7mil, pad to pad 7mil, via to via 7mil, smd to smd 7mil, copper to edge 7mil, drill to drill 7mil, minimum pad ring 7mil, minimum via ring 7mil, stop-mask expansion 3mil, vias tented up to drill 25mil, thermal gap 10mil

### Footprints (pad centres in the part's own frame; a part is rotated, then mirrored left to right if it is on the bottom)
CAPC1005X60 = smd 0.56 x 0.629: 1 -0.485,0; 2 0.485,0
CAPC1608X85 = smd 0.921 x 0.97: 1 -0.775,0; 2 0.775,0
CAPC3216X135 = smd 1.165 x 1.815: 1 -1.475,0; 2 1.475,0
LED-TRICOLOR-5050 = smd 2 x 1.1: 1 2.4,-1.7; 2 2.4,0; 3 2.4,1.7; 4 -2.4,1.7; 5 -2.4,0; 6 -2.4,-1.7
SMT-JUMPER_2_NC_TRACE_SILK = smd 0.635 x 1.27: 1 -0.508,0; 2 0.508,0
1206 = smd 1.6 x 1.8: 1 -1.4,0; 2 1.4,0
SMT-JUMPER_2_NO_SILK = smd 0.635 x 1.27: 1 -0.406,0; 2 0.406,0
HRO_TYPE-C-31-M-12 = smd 0.6 x 1.45: A1B12 -3.25,5.095; A4B9 -2.45,5.095; B1A12 3.25,5.095; B4A9 2.45,5.095 | smd 0.3 x 1.45: A5 -1.25,5.095; A6 -0.25,5.095; A7 0.25,5.095; A8 1.25,5.095; B5 1.75,5.095; B6 0.75,5.095; B7 -0.75,5.095; B8 -1.75,5.095 | drill 0.65 pad 1.05 long: S1 -4.32,4.18; S2 4.32,4.18; S3 -4.32,0; S4 4.32,0 | hole 0.7: -2.89,3.65; 2.89,3.65
1X14_NO_SILK = drill 1.016 pad 1.88: 1 0,0; 2 2.54,0; 3 5.08,0; 4 7.62,0; 5 10.16,0; 6 12.7,0; 7 15.24,0; 8 17.78,0; 9 20.32,0; 10 22.86,0; 11 25.4,0; 12 27.94,0; 13 30.48,0; 14 33.02,0
1X19_NO_SILK = drill 1.016 pad 1.88: 1 0,0; 2 2.54,0; 3 5.08,0; 4 7.62,0; 5 10.16,0; 6 12.7,0; 7 15.24,0; 8 17.78,0; 9 20.32,0; 10 22.86,0; 11 25.4,0; 12 27.94,0; 13 30.48,0; 14 33.02,0; 15 35.56,0; 16 38.1,0; 17 40.64,0; 18 43.18,0; 19 45.72,0
1X06_NO_SILK = drill 1.016 pad 1.88: 1 0,0; 2 2.54,0; 3 5.08,0; 4 7.62,0; 5 10.16,0; 6 12.7,0
1X01_NO_SILK = drill 1.016 pad 1.88: 1 0,0
LED-0603 = smd 1 x 1: A -0.877,0; C 0.877,0
ARDUINO-TRANSISTORS_SOT363 = smd 0.5 x 0.6: 1 -0.75,-0.9; 3 0.75,-0.9; 4 0.75,0.9; 6 -0.75,0.9 | smd 0.4 x 0.6: 2 0,-0.9; 5 0,0.9
SOT65P210X110-3N = smd 1.168 x 0.457: 1 -0.94,0.66; 2 -0.94,-0.66; 3 0.94,0
RESC1005X40 = smd 0.535 x 0.644: 1 -0.507,0; 2 0.507,0
RESPACK_4X0402 = smd 0.87 x 0.41: 1 -0.58,0.825; 4 -0.58,-0.825; 5 0.58,-0.825; 8 0.58,0.825 | smd 0.87 x 0.26: 2 -0.58,0.25; 3 -0.58,-0.25; 6 0.58,-0.25; 7 0.58,0.25
SW2-2.6-3.9X2.9X1.5+0.4MM = smd 1 x 2: 1 -2.4,0; 2 2.4,0
1X04_1MM_RA = smd 0.6 x 1.35: 1 -1.5,0; 2 -0.5,0; 3 0.5,0; 4 1.5,0 | smd 1.2 x 2: NC1 2.8,-3.675; NC2 -2.8,-3.675
TQFP48 = smd 1.016 x 0.305: 1 -4.191,2.794; 2 -4.191,2.286; 3 -4.191,1.778; 4 -4.191,1.27; 5 -4.191,0.762; 6 -4.191,0.254; 7 -4.191,-0.254; 8 -4.191,-0.762; 9 -4.191,-1.27; 10 -4.191,-1.778; 11 -4.191,-2.286; 12 -4.191,-2.794; 25 4.191,-2.794; 26 4.191,-2.286; 27 4.191,-1.778; 28 4.191,-1.27; 29 4.191,-0.762; 30 4.191,-0.254; 31 4.191,0.254; 32 4.191,0.762; 33 4.191,1.27; 34 4.191,1.778; 35 4.191,2.286; 36 4.191,2.794 | smd 0.305 x 1.016: 13 -2.794,-4.191; 14 -2.286,-4.191; 15 -1.778,-4.191; 16 -1.27,-4.191; 17 -0.762,-4.191; 18 -0.254,-4.191; 19 0.254,-4.191; 20 0.762,-4.191; 21 1.27,-4.191; 22 1.778,-4.191; 23 2.286,-4.191; 24 2.794,-4.191; 37 2.794,4.191; 38 2.286,4.191; 39 1.778,4.191; 40 1.27,4.191; 41 0.762,4.191; 42 0.254,4.191; 43 -0.254,4.191; 44 -0.762,4.191; 45 -1.27,4.191; 46 -1.778,4.191; 47 -2.286,4.191; 48 -2.794,4.191
ESP-32S = smd 1.5 x 1: 1 -9.25,7; 2 -9.25,5.73; 3 -9.25,4.46; 4 -9.25,3.19; 5 -9.25,1.92; 6 -9.25,0.65; 7 -9.25,-0.62; 8 -9.25,-1.89; 9 -9.25,-3.16; 10 -9.25,-4.43; 11 -9.25,-5.7; 12 -9.25,-6.97; 13 -9.25,-8.24; 14 -9.25,-9.51; 25 9.25,-9.51; 26 9.25,-8.24; 27 9.25,-6.97; 28 9.25,-5.7; 29 9.25,-4.43; 30 9.25,-3.16; 31 9.25,-1.89; 32 9.25,-0.62; 33 9.25,0.65; 34 9.25,1.92; 35 9.25,3.19; 36 9.25,4.46; 37 9.25,5.73; 38 9.25,7 | smd 1 x 1.5: 15 -5.7,-11.25; 16 -4.43,-11.25; 17 -3.16,-11.25; 18 -1.89,-11.25; 19 -0.62,-11.25; 20 0.65,-11.25; 21 1.92,-11.25; 22 3.19,-11.25; 23 4.46,-11.25; 24 5.73,-11.25 | smd 4.5 x 4.5: GND 0.68,-0.33
SOIC127P1030X265-20N = smd 1.9 x 0.6: 1 -4.605,5.715; 2 -4.605,4.445; 3 -4.605,3.175; 4 -4.605,1.905; 5 -4.605,0.635; 6 -4.605,-0.635; 7 -4.605,-1.905; 8 -4.605,-3.175; 9 -4.605,-4.445; 10 -4.605,-5.715; 11 4.605,-5.715; 12 4.605,-4.445; 13 4.605,-3.175; 14 4.605,-1.905; 15 4.605,-0.635; 16 4.605,0.635; 17 4.605,1.905; 18 4.605,3.175; 19 4.605,4.445; 20 4.605,5.715
TSSOP16 = smd 0.305 x 0.991: 1 -2.275,-2.918; 2 -1.625,-2.918; 3 -0.975,-2.918; 4 -0.325,-2.918; 5 0.325,-2.918; 6 0.975,-2.918; 7 1.625,-2.918; 8 2.275,-2.918; 9 2.275,2.918; 10 1.625,2.918; 11 0.975,2.918; 12 0.325,2.918; 13 -0.325,2.918; 14 -0.975,2.918; 15 -1.625,2.918; 16 -2.275,2.918
SOT23-5L = smd 0.55 x 1.2: 1 -0.95,-1.3; 2 0,-1.3; 3 0.95,-1.3; 4 0.95,1.3; 5 -0.95,1.3
SOT230P696X180-4N = smd 1.6 x 0.838: 1 -3.2,2.311; 2 -3.2,0; 3 -3.2,-2.311 | smd 1.6 x 3.099: 4 3.2,0
SOT95P280X110-6N = smd 1.119 x 0.584: 1 -1.246,0.95; 2 -1.246,0; 3 -1.246,-0.95; 4 1.246,-0.95; 5 1.246,0; 6 1.246,0.95

### Placement (x,y rotation side)
C1  9.53,9.53 0 top
C2  25.4,6.67 135 top
C3  24.77,5 135 top
C4  60.64,24.13 270 top
C5  37.78,20.56 180 top
C6  40.72,3.33 0 top
C7  24.61,9.21 315 top
C8  15.08,11.43 315 top
C9  25.08,19.21 135 top
C10  25.96,20.08 135 top
C11  23.73,8.33 315 top
C12  22.78,7.38 315 top
D1  35.24,16.75 180 top
ESP_EN  46.67,10.32 270 bottom
F1  13.34,3.65 0 top
IO0  33.97,3.81 180 bottom
J1  2.54,5.4 270 top
J2  10.48,1.27 0 top
J3  56.2,24.13 180 top
J4  46.04,1.27 0 top
J5  58.74,24.13 0 top
LED  21.19,6.51 270 top
Q1  29.84,14.29 180 top
Q2  6.99,23.81 0 top
Q3  15.32,18.81 45 top
Q4  37.39,3.81 0 top
R1  11.75,9.53 0 top
R2  9.53,3.81 180 top
R3  27.38,17.54 45 top
R4  26.51,18.41 45 top
R5  30.48,16.51 180 top
R6  40.4,7.3 90 top
R7  22.7,5.64 45 top
R8  33.97,3.49 180 top
R9  61.91,24.13 90 top
R10  40.32,16.83 270 top
R11  40.72,4.76 180 top
R12  29.61,11.99 135 top
R13  27.86,14.29 270 top
R14  17.62,21.11 45 top
R15  3.49,23.73 90 top
RESET  15.88,7.14 0 top
SPI  5.56,17.62 180 bottom
U1  20.95,14.29 315 top
U2  53.98,12.7 270 top
U3  6.83,16.51 270 top
U4  36.99,11.11 270 top
U5  37.47,6.67 90 top
U$1  [LABEL-GND0]  56.2,2.38 90 bottom
U$2  [LABEL-GND0]  20.64,18.18 90 bottom
U$3  [LABEL-NC0]  48.58,2.38 90 bottom
U$4  [LABEL-NC0]  46.04,2.38 90 bottom
U$5  [LABEL-#3#A159]  48.58,16.19 90 bottom
U$6  [SSTUINOII-REVA-FUTURA-1LINE]  26.35,20.8 0 top
U$7  [LABEL-#6#A1412]  40.96,16.19 90 bottom
U$8  [LABEL-#511]  43.5,19.53 90 bottom
U$9  [LABEL-#916]  33.34,19.53 90 bottom
U$10  [LABEL-#1017]  30.64,18.89 90 bottom
U$11  [LABEL-0#RX17]  56.2,17.14 90 bottom
U$12  [LABEL-1#TX18]  53.66,17.22 90 bottom
U$13  [LABEL-2#TX214]  51.12,16.67 90 bottom
U$14  [LABEL-3#3V6]  18.1,2.38 90 bottom
U$15  [LABEL-7#RX213]  38.42,16.83 90 bottom
U$16  [LABEL-8#A1115]  35.88,17.38 90 bottom
U$17  [LABEL-11#A818]  28.26,17.38 90 bottom
U$18  [LABEL-12#A919]  25.72,17.07 90 bottom
U$19  [LABEL-13#A1020]  23.18,16.43 90 bottom
U$20  [LABEL-20#SDA2]  15.56,15.88 90 bottom
U$21  [LABEL-21#SCL3]  13.02,16.35 90 bottom
U$22  [LABEL-410]  46.04,20.32 90 bottom
U$23  [LABEL-AREF4]  18.1,17.38 90 bottom
U$24  [LABEL-SWCLK1]  13.02,2.38 90 bottom
U$25  [LABEL-SWDIO0]  10.48,2.38 90 bottom
U$26  [LABEL-5V5]  58.74,2.3 90 bottom
U$27  [LABEL-A01]  20.64,2.3 90 bottom
U$28  [LABEL-IO03]  43.5,2.3 90 bottom
U$29  [LABEL-A23]  25.72,2.14 90 bottom
U$30  [LABEL-A34]  28.26,2.3 90 bottom
U$31  [LABEL-A45]  30.8,2.3 90 bottom
U$32  [LABEL-A56]  35.24,6.99 0 bottom
U$33  [LABEL-EN4]  40.96,2.38 90 bottom
U$34  [LABEL-RST0]  15.56,2.38 90 bottom
U$35  [LABEL-TX8]  51.12,2.22 90 bottom
U$36  [LABEL-RX7]  53.66,2.38 90 bottom
U$37  [LABEL-SCL5]  38.58,2.38 90 bottom
U$38  [LABEL-SDA6]  36.27,2.38 90 bottom
U$39  [LABEL-RESETN9]  10.48,15.56 90 bottom
U$40  [LABEL-A10]  23.18,2.38 90 bottom
U$41  [SSTUINOII-REVA-FUTURA-2]  59.37,9.53 0 bottom
U$42  [SST-LOGO-SVG]  27.62,9.53 0 bottom
VR1  30.88,6.19 0 top
Z1  11.11,6.67 270 top

### Tracks (layer width: path | path; a pad name or v marks a point on that pad's centre or on a via)
3.3V  (via drill 0.35)
  Top 0.254: U5.5 36.45,5.44 Q4.1 | Q3.5 Q3.2 | v8.41,13.49 8.73,13.18 U3.17 8.73,9.83 C1.1 | R8.2 33.07,3.1 v32.07,3.1 | v32.07,4.67 32.14,4.74 33.02,4.74 33.4,5.12 33.4,5.52 VR1.4 | v30.85,11.45 30.14,11.45 R12.1 30.08,11.74 30.08,12.78 29.84,13.02 Q1.5 Q1.2 29.84,16.38 R5.2 | Q3.5 14.45,19.68 14.45,20.77 15.19,21.52 15.74,21.52 15.84,21.42 16.04,21.42 16.66,22.04 17.39,22.04 R14.8 | Q3.5 14.37,19.76 13.97,19.76 13.26,19.05 11.43,19.05 11.01,18.63 8.49,18.63 v7.94,19.19 8.07,19.32 8.07,22.43 7.04,23.46 7.04,23.48 Q2.1 5.88,24.31 R15.5 R15.6 R15.7 R15.8 | U4.1 35.88,13.39 | 35.88,13.39 36.14,13.39 36.2,13.34 | 35.88,13.39 36.14,13.65 36.2,13.65 | 35.88,13.39 35.88,13.34 36.2,13.02 | U2.2 59.69,21.96 59.69,23.08 60.02,23.42 60.02,24.13 60.51,24.61 C4.1 60.66,24.64 R9.2
  Top 0.508: 27.61,6.12 VR1.2 | v7.94,16.41 7.94,13.97 v8.41,13.49 | v41.91,21.96 41.91,21.89 40.58,20.56 C5.1 | 59.69,21.93 U2.2 | v36.2,9.91 36.2,13.02 36.2,13.34 36.2,13.65 v36.2,17.78 | 33.66,6.35 33.97,6.67 34.08,6.56 VR1.4 | 31.11,6.35 31.04,6.43
  Top 0.61: VR1.4 35.22,6.19 35.69,5.72 U5.5 | C2.1 27.61,6.12 | VR1.2 28.63,6.19 29.11,6.67 v29.21,6.67 29.53,6.35 31.04,6.35 31.04,6.43 v31.04,7.06 | v59.69,20.32 59.69,21.93 | 31.11,6.35 33.66,6.35
  Bottom 0.254: v32.07,3.1 v32.07,4.67
  Bottom 0.406: 20.43,5.96 20.36,5.96 20.04,6.28 18.16,6.28 18.1,6.35
  Bottom 0.508: v7.94,19.19 v7.94,16.41 | 20.43,5.96 23.82,5.96 24.13,6.27 28.81,6.27 v29.21,6.67 29.21,9.78 29.25,9.81 29.25,9.95 30.66,11.36 30.76,11.36 v30.85,11.45 | 8.89,13.02 v8.41,13.49 | v41.91,21.96 41.86,21.91 | v36.2,9.91 36.07,9.79 32.15,9.79 31.04,8.67 v31.04,7.06 | v36.2,17.78 36.2,17.93
  Bottom 0.61: 8.89,13.02 8.89,10.81 11.89,7.81 11.89,5.32 12.73,4.47 14,4.47 15.88,6.35 16.91,6.35 | J2.4 16.91,2.46 16.91,6.35 | 41.86,21.91 37.47,21.91 36.66,21.11 36.66,18.4 36.2,17.93 | v41.91,21.96 46.15,21.96 49.9,18.21 58.02,18.21 59.69,19.88 v59.69,20.32 | 16.91,6.35 18.1,6.35
5V  (via drill 0.35)
  Top 0.254: 32.51,3.88 32.75,4.12 35.24,4.12 35.42,3.94 36.95,3.94 37.62,3.28 39.04,3.28 39.21,3.46 39.21,4.17 39.8,4.76 R11.2 40.48,5.03 v40.48,5.95 40.48,6.72 R6.1 | C7.1 23.9,9.55 U1.28 22.61,10.84 21.9,10.84 21.61,11.13 | R14.5 R14.6 18.56,21.7 18.56,22.04 17.74,22.86 17.48,22.86 17.1,22.48 16.48,22.48 15.96,21.95 15.02,21.95 13.97,20.91 13.97,20.38 13.16,19.56 11.97,19.56 v11.82,19.71 | 18.6,12.58 20.16,12.58 21.61,11.13 | v27,15.18 27.47,15.18 R13.1 27.86,14.95 29.16,16.25 29.16,16.71 29.64,17.2 29.8,17.2 30.18,17.59 30.18,18.13 29.8,18.52 29.25,18.52 28.64,17.9 R3.2 R4.2 26.87,19.17 C10.1 C9.1 25.06,18.5 25.06,18.1 24.1,17.14 U1.42 | 21.61,11.02 21.61,11.13 | 15.82,12.38 U1.14 16.95,13.51
  Top 0.305: 18.6,12.58 17.66,13.51 16.95,13.51 | 15.35,12.38 15.82,12.38
  Top 0.406: F1.2 15.08,3.65 16.14,2.59 18.86,2.59 v19.3,2.15 | v21.3,10.71 21.61,11.02 | C8.1 15.35,12.38
  Top 0.508: F1.2 14.41,3.98 14.41,8.32 13.65,9.08 13.65,10.69 C8.1 | 30.56,3.88 32.51,3.88
  Top 0.61: C3.1 25.63,4.13 27.34,4.13 27.6,3.88 VR1.3 28.97,3.88 v29.77,3.09 30.56,3.88 | C8.1 14.66,11.77 13.02,13.41 12.26,13.41 11.83,13.85 10.76,13.85 10.06,14.55 v10.06,16.83
  Bottom 0.254: v27,15.18 26.54,14.73 24.61,14.73 23.04,13.16 23.04,11.79 22.66,11.41 21.99,11.41 v21.3,10.71
  Bottom 0.406: v40.48,5.95 40.88,6.35 41.83,6.35 42.72,7.24
  Bottom 0.508: 47.94,6.99 47.62,6.67 46.04,6.67 45.46,7.24 42.72,7.24
  Bottom 0.61: v11.82,19.71 10.06,17.95 v10.06,16.83 | v19.3,2.15 20.1,2.96 29.64,2.96 v29.77,3.09 | J4.6 58.74,2.86 57.78,3.81 54.93,3.81 53.66,5.08 53.66,6.03 52.7,6.99 47.94,6.99
BLU
  Top 0.254: D1.6 38.99,17.1 38.99,16.85 39.5,16.34 R10.5
CC1
  Top 0.254: R1.1 10.49,8.78 9.74,8.78 9.57,8.6 9.57,7.62 8.59,6.65 J1.A5
CC2
  Top 0.254: J1.B5 7.68,3.69 8.49,3.69 8.6,3.81 R2.2
D_N  (via drill 0.35)
  Top 0.254: Z1.3 10,7.91 10,7.44 8.7,6.15 J1.B7 6.62,6.15 v6.38,6.39 | U3.14 4.92,10.4 4.6,10.08 4.6,6.24 v5.73,5.11 7.6,5.11 J1.A7
  Bottom 0.254: v6.38,6.39 5.73,5.74 v5.73,5.11
D_P  (via drill 0.35)
  Top 0.254: Z1.1 12.06,7.3 11.43,6.67 9.84,6.67 8.83,5.66 8.78,5.66 8.77,5.65 J1.A6 6.19,5.65 5.42,6.42 v5.42,6.47 5.08,6.8 5.08,9.84 6.19,10.95 U3.15 | J1.B6 6.9,4.65 6.86,4.6 6.78,4.6 v6.2,4.01 v6.19,4.01
  Bottom 0.254: v5.42,6.47 5.42,6.05 5,5.64 5,4.84 5.83,4.01 v6.19,4.01
ESP_ACK  (via drill 0.35)
  Top 0.254: U2.9 50.81,20.68 48.87,18.73 47.97,18.73 v47.97,18.71 | R12.2 29.09,12.5 Q1.4 29.09,14.25 v29.13,14.29
  Bottom 0.254: v47.97,18.71 46.04,20.64 38.1,20.64 37.38,19.92 37.38,18.04 34.27,14.92 29.77,14.92 v29.13,14.29
ESP_BLUE
  Top 0.254: U2.12 47.01,20.88 46.35,20.23 41.65,20.23 39.5,18.07 R10.4
ESP_CS  (via drill 0.35)
  Top 0.254: U2.29 49.48,3.52 49.48,4.25 47.9,5.82 45.9,5.82 45.45,5.37 43.3,5.37 v43.23,5.44 | U5.1 v37.47,5.71 37.07,6.11 37.07,6.24 36.91,6.39 36.91,6.94 37.07,7.1 37.07,8.02 34.93,10.16 34.09,10.16 U4.6
  Bottom 0.254: v37.47,5.71 37.78,6.03 38.42,6.03 39.79,4.66 41.27,4.66 41.86,5.25 43.05,5.25 v43.23,5.44
ESP_EN  (via drill 0.35)
  Top 0.254: J2.13 41.2,1.52 C6.2 42.2,3.33 v42.23,3.3 | 58.44,17.3 58.44,8.89 57.46,7.92 55.31,7.92 54.93,8.3 49.98,8.3 v49.53,8.75 49.19,9.09 44.89,9.09 44.6,8.81 44.6,6.86 v45,6.46 | 58.44,17.3 58.44,17.62 | U2.3 58.44,17.94 | 58.44,17.94 58.44,17.62 | 58.75,17.62 61.52,17.62 61.91,18.02 R9.1 | 58.75,17.62 58.44,17.62 | 58.44,17.94 58.75,17.62 | 58.75,17.62 58.44,17.3
  Bottom 0.254: v42.23,3.3 42.55,3.3 42.62,3.38 44.13,3.38 44.83,4.08 44.83,6.29 v45,6.46 | v49.53,8.75 49.32,8.75 48.26,9.81 ESP_EN.2
ESP_EN_PRE  (via drill 0.35)
  Top 0.254: U4.4 34.09,11.45 v35.41,11.45
  Bottom 0.254: v35.41,11.45 35.54,11.33 45.27,11.33 45.76,10.83 ESP_EN.1
ESP_GREEN
  Top 0.254: U2.10 49.55,20.02 48.9,19.37 42.01,19.37 40.57,17.93 R10.2
ESP_IO0
  Top 0.203: 41.59,4.14 41.7,4.14 41.9,3.94 42.73,3.94 43.13,3.54 | Q4.2 37.17,3.15 37.45,2.87 39.2,2.87 39.62,3.29 39.62,3.83 39.93,4.14
  Top 0.254: R8.1 36.1,3.49 Q4.2 | U2.25 43.5,2.48 J2.14 43.5,3.17 43.13,3.54 | 39.93,4.14 41.59,4.14
ESP_MISO  (via drill 0.35)
  Top 0.254: U2.37 59.24,3.92 59.24,6.46 58.22,7.48 47.56,7.48 v46.7,8.33 | v37.57,6.67 U5.2
  Bottom 0.254: v37.57,6.67 38.52,7.62 40.64,7.62 41.43,8.41 46.62,8.41 v46.7,8.33
ESP_MOSI  (via drill 0.35)
  Top 0.254: v41.12,15.21 41.12,13.18 40.64,12.7 39.94,12.7 U4.15 | v39.17,18.68 39.49,18.68 41.48,20.66 45.4,20.66 45.73,21 U2.13
  Bottom 0.254: v39.17,18.68 39.17,17.16 v41.12,15.21
ESP_RED
  Top 0.254: U2.11 48.27,20.34 47.74,19.8 41.83,19.8 40.07,18.04 R10.3
ESP_RX  (via drill 0.35)
  Top 0.254: U4.10 40.74,9.49 v40.94,9.68 | v44.09,9.68 50.01,9.68 50.64,9.05 55.43,9.05 v55.88,8.6 | v55.88,4.76 55.9,4.75 U2.34
  Bottom 0.254: v44.09,9.68 v40.94,9.68 | v55.88,8.6 v55.88,4.76
ESP_RX_5V  (via drill 0.35)
  Top 0.254: v47.31,4.73 46.65,5.39 46.08,5.39 45.63,4.94 43.66,4.94 43.5,4.78 42.96,4.78 42.39,5.34 42.01,5.34 41.16,6.2 41.16,8.37 40.69,8.84 U4.9
  Bottom 0.254: v47.31,4.73 47.31,3.89 47.94,3.26 50.89,3.26 52.88,1.27 J4.4
ESP_SCK
  Top 0.254: U2.30 50.35,3.92 50.35,4.33 48.42,6.25 45.73,6.25 45.27,5.8 44.11,5.8 43.82,6.09 41.88,6.09 41.59,6.38 41.59,10.48 41.28,10.79 U4.12
ESP_SCL  (via drill 0.35)
  Top 0.254: v52.07,5.42 57.76,5.42 58.44,4.75 U2.36
  Bottom 0.254: v52.07,5.42 51.77,5.12 51.77,4.49 50.97,3.69 48.58,3.69 47.97,4.3 47.97,5 47.58,5.39 46.08,5.39 45.7,5 45.7,4.46 45.72,4.44 45.72,3.49 44.74,2.52 42.98,2.52 42.46,1.99 42,1.99 41.47,2.52 40.44,2.52 39.2,1.27 J2.12
ESP_SDA  (via drill 0.35)
  Top 0.254: v51.12,4.76 54.29,4.76 54.62,4.43 U2.33
  Bottom 0.254: J2.11 37.15,2.54 39.86,2.54 40.26,2.95 41.65,2.95 42.11,2.48 42.34,2.48 42.8,2.95 44.56,2.95 45.27,3.65 45.27,5.18 45.9,5.82 47.76,5.82 48.4,5.18 48.4,4.62 48.9,4.12 50.48,4.12 v51.12,4.76
ESP_TX  (via drill 0.35)
  Top 0.254: v44.13,10.64 47.33,10.64 51.27,14.57 56.18,14.57 56.54,14.22 56.54,8.87 v56.83,8.57 | v57.15,4.76 57.16,4.75 U2.35 | v32.49,11.27 32.49,11.56 31.31,12.74 31.31,14.73 30.85,15.19 Q1.1 30.59,16.12 R5.1
  Bottom 0.254: v56.83,8.57 56.83,5.08 v57.15,4.76 | v32.49,11.27 33.13,10.64 v44.13,10.64
ESP_TX_5V  (via drill 0.35)
  Top 0.254: v46.35,4.73 46.04,4.73 45.81,4.5 43.84,4.5 43.68,4.35 42.38,4.35 v42.13,4.6 41.97,4.76 R11.1 | v30.99,10.58 31.72,11.31 31.72,11.72 30.59,12.84 Q1.6 30.59,14.23 v30.56,14.27 | v32.75,5.4 32.68,5.33 v28.89,5.33
  Bottom 0.254: J4.3 50.66,1.27 49.1,2.83 47.02,2.83 46.35,3.49 v46.35,4.73 | v28.89,5.33 29.1,5.53 29.16,5.53 29.87,6.24 29.87,9.46 v30.99,10.58 | v32.75,5.4 33.09,5.06 37.74,5.06 37.93,5.25 38.59,5.25 39.61,4.23 41.45,4.23 41.82,4.6 v42.13,4.6
GND  (via drill 0.35)
  Top 0.203: C8.2 15.75,11.41 15.75,11.69 16.12,12.06 16.21,12.06 U1.15 | C6.1 40.23,2.45 40.01,2.22 39.19,2.22 38.92,2.49 35.68,2.49 v35.33,2.83 | U4.8 34.07,8.35 33.97,8.26 | v27.7,7.38 28.5,7.38 28.57,7.3 28.89,7.3 29.69,8.1 31.51,8.1 31.51,7.86 31.91,7.46 32.07,7.46 v32.31,7.22
  Top 0.254: Z1.2 11.11,8.73 11.27,8.89 12.7,8.89 v12.86,8.73 | J1.S1 7.63,8.8 J1.A1B12 | 6.72,1.23 J1.S2 | C10.2 25.84,20.43 26.04,20.62 26.76,20.62 v26.83,20.56 | C9.2 24.74,19.09 24.63,18.97 24.63,18.32 U1.43 23.33,17.02 22.35,17.02 22.11,17.26 | 22.11,17.26 v21.91,17.46 | 33.97,8.26 33.34,8.26 v32.31,7.22 | v20.17,15.92 20.76,15.92 22.11,17.26 | 10.03,4.02 R2.1 | v25.8,8.1 25.8,8.89 24.41,10.28 23.89,10.28 U1.29 22.76,11.41 22.11,11.41 20.26,13.26 v20,13.26
  Top 0.305: J1.B1A12 6.72,1.23
  Top 0.406: U3.16 7.46,10.46 J1.S1 | v12.86,8.73 13.47,8.12 RESET.1 | v9.05,5 10.03,4.02
  Top 0.508: R7.2 23.77,5.99 C3.2 | C4.2 60.98,23.31 U2.1
  Bottom 0.203: v35.33,2.83 36.05,3.55 40.64,3.55 | 42.56,5.74 42.89,6.07 43.49,6.07 43.86,5.7 43.86,5.17 42.84,4.15 | 40.67,3.55 40.64,3.55 | 42.65,3.96 42.84,4.15 | 42.84,4.15 42.58,4.15 42.37,3.93 41.97,3.93 41.59,3.56 41.59,3.36 41.59,3.35 40.84,3.35 40.64,3.55
  Bottom 0.254: 41.2,5.74 40.75,5.3 40.21,5.3 39.82,5.68 39.82,6.23 40.46,6.86 41.47,6.86 42.41,7.8 45.86,7.8 46.04,7.62
  Bottom 0.305: 42.56,5.74 41.2,5.74
  other vias: 50.48,11.75 44.77,18.41 60.96,6.03 31.11,18.1 28.57,20.32 34.92,20.56 38.73,8.49 14.68,10.24 54.93,6.35 50.48,5.71 10.56,10.4 14.92,13.57 35.24,14.92 35.24,17.14 60.96,12.7 60.96,18.73 57.47,12.7 57.63,19.61 57.78,6.35 54.77,19.61 54.77,16.43 47.62,15.56 60.96,16.35 52.07,13.65 55.24,13.65 55.24,10.48 52.07,10.48 48.58,10.48 44.77,15.56 52.86,16.43 52.86,19.61 60.96,9.21 57.47,9.53 57.47,15.88 13.18,14.29
  pour Top (isolate 0.254): 0,25.4 61.91,25.4 61.91,0 0,0
  pour Bottom (isolate 0.254): 0,25.4 61.91,25.4 61.91,0 0,0
GRN
  Top 0.254: R10.7 40.57,15.6 40.46,15.48 40.46,15.38 40.01,14.92 37.77,14.92 D1.4
IO0_5V  (via drill 0.35)
  Top 0.254: v38.2,4.59 38.2,3.93 Q4.3 38.33,3.9 39.77,5.35 39.77,7.19 39.95,7.37 39.96,7.37 R6.2
  Bottom 0.254: IO0.2 34.53,3.96 37.57,3.96 v38.2,4.59
N$2
  Top 0.254: LED.C 21.99,5.63 R7.1
PA0_D2  (via drill 0.35)
  Top 0.203: 24.02,19.37 24.02,20.11 v24.56,20.65
  Top 0.254: v28.06,18.77 28.37,19.09 30.16,19.09 30.99,19.92 34.7,19.92 35.28,19.35 37.02,19.35 37.28,19.61 v38.1,19.61 | v47.62,17.76 47.85,17.98 48.76,17.98 51.44,20.67 v52.39,20.67 | U1.44 24.02,18.43 24.02,19.37
  Bottom 0.254: v24.56,20.65 26.44,18.77 v28.06,18.77 | J3.3 52.39,22.86 v52.39,20.67 | v47.62,17.76 45.77,19.61 v38.1,19.61
PA1_D7
  Top 0.254: J3.8 38.42,22.78 37.89,22.25 34.61,22.25 33.67,21.32 24.25,21.32 23.58,20.65 23.58,18.78 23.02,18.22 U1.45
PA2_D20_SDA  (via drill 0.35)
  Top 0.254: v21.66,20.97 21.96,20.66 22.27,20.66 23.15,19.78 23.15,19.07 22.66,18.58 U1.46
  Bottom 0.254: J3.17 18.8,20.89 21.58,20.89 v21.66,20.97
PA3_D21_SCL  (via drill 0.35)
  Top 0.254: U1.47 22.3,18.94 22.71,19.35 22.71,19.6 22.17,20.15 v21.27,20.15
  Bottom 0.254: v21.27,20.15 20.97,20.45 17.47,20.45 17.06,20.87 13.8,24.13 J3.18
PA6_D28  (via drill 0.35)
  Top 0.254: U1.2 20.58,17.89 20.74,17.89 21.12,17.51 21.12,16.96 20.74,16.58 19.32,16.58 v19.02,16.28 | v18.41,5.55 18.44,5.52 18.74,5.52 19.34,6.11 v19.34,7.04
  Bottom 0.254: v19.02,16.28 18.64,15.9 18.64,15.24 18.25,14.86 15.04,14.86 11.25,11.07 11.25,10.21 11.63,9.82 13.29,9.82 15.06,8.05 17.97,8.05 18.57,8.65 19.61,8.65 20,8.26 20,7.7 v19.34,7.04 | v18.41,5.55 18.8,5.55 20.61,3.74 30.24,3.74 31.55,2.44 32.5,2.44 33.57,3.5 IO0.1
PA7_D29  (via drill 0.35)
  Top 0.254: U4.5 33.64,10.79 33.27,10.42 33.27,10.17 33.02,9.92 29.92,9.92 29.54,10.3 29.54,11.1 26.28,14.36 25.62,14.36 24.79,15.2 23.64,15.2 23.41,14.97 22.79,14.97 22.48,15.28 22.05,15.28 v21.83,15.51 | v20.47,17.24 20.47,17.29 U1.3 | U1.3
  Bottom 0.254: v21.83,15.51 21.83,15.88 v20.47,17.24
PB0_D9~
  Top 0.254: J3.10 33.34,23.18 32.38,22.23 21.34,22.23 18.48,19.36 18.48,18.63 18.89,18.22 U1.4
PB1_D10~
  Top 0.254: J3.11 30.8,23.5 29.96,22.66 21.16,22.66 18.02,19.51 18.02,18.3 U1.5
PB2_D5~  (via drill 0.35)
  Top 0.254: v19.52,17.3 v19.51,17.3 19.23,17.02 18.58,17.02 U1.6 | v20.93,18.63 20.93,19.54 20.61,19.86 20.61,20.89 21.52,21.79 33.2,21.79 34.09,22.68 36.92,22.68 v37.15,22.91
  Bottom 0.254: v19.52,17.3 20.85,18.63 v20.93,18.63 | J3.6 42.07,22.7 37.35,22.7 v37.15,22.91
PB4_D27_TX0
  Top 0.203: Q3.3 16.19,19 16.19,19.37 16.43,19.61 16.45,19.61 17.37,20.53 R14.3
  Top 0.254: Q3.3 17.04,18.15 17.04,17.12 U1.8
PB5_D26_RX0  (via drill 0.35)
  Top 0.254: Q3.6 13.91,18.68 13.91,17.92 v14.49,17.34 14.87,16.96 15.6,16.96 15.86,17.22 16.22,17.22 U1.9 | R14.4 17.79,20.02 v17.12,19.34
  Bottom 0.254: v14.49,17.34 14.72,17.57 15.09,17.57 16.86,19.34 v17.12,19.34
PC0_MOSI  (via drill 0.35)
  Top 0.254: v32.23,8.3 31.91,8.62 29.35,8.62 28.14,9.83 28.14,10.66 27.5,11.31 26.34,11.31 v26.25,11.4 | v23.72,12.76 22.81,13.67 22.25,13.67 21.94,13.98 16.5,13.98 15.49,14.99 12.91,14.99 12.43,14.5 11.24,14.5 10.77,14.97 10.77,16.45 11.29,16.97 v11.61,16.97 12.48,16.97 12.94,16.51 16.22,16.51 U1.10 | v37.47,9.86 37.47,11.43 38.12,12.09 U4.14
  Bottom 0.254: v26.25,11.4 24.89,12.76 v23.72,12.76 | v32.23,8.3 32.36,8.17 33.21,8.17 33.82,8.78 36.31,8.78 36.55,8.54 37.09,8.54 37.48,8.93 37.48,9.47 37.47,9.48 v37.47,9.86 | v11.61,16.97 11.21,16.97 9.88,15.64 7.46,15.64 7.06,16.04 SPI.4
PC1_MISO  (via drill 0.35)
  Top 0.254: v24.98,14.07 24.51,14.54 22.61,14.54 22.3,14.85 17.16,14.85 U1.11 15.93,16.08 11.95,16.08 v11.91,16.03 | U5.4 36.16,6.89 v36.02,6.74 | v27.01,10.59 27.01,9.49 26.57,9.05 26.57,7.83 24.97,6.23 24.97,5.98 25.8,5.15 27.27,5.15 27.75,4.67 v30.16,4.67 v30.17,4.66
  Bottom 0.254: v24.98,14.07 25.76,14.07 27.14,12.69 27.14,11.27 27.01,11.14 v27.01,10.59 | v30.17,4.66 31.05,4.66 32.92,6.53 35.81,6.53 v36.02,6.74 | v11.91,16.03 11.2,16.03 10.38,15.21 6.86,15.21 6.06,16.01 SPI.3
PC2_SCK  (via drill 0.35)
  Top 0.254: v36.82,9.2 38.41,9.2 39.35,10.14 U4.11 | v32.94,8.83 32.72,9.06 29.53,9.06 28.57,10.01 28.57,10.84 27.08,12.34 v26.4,12.34 | v24.38,13.41 23.69,14.11 22.43,14.11 22.12,14.42 16.88,14.42 U1.12 15.71,15.58 12.89,15.58 12.47,15.16 v11.68,15.16
  Bottom 0.254: v26.4,12.34 25.33,13.41 v24.38,13.41 | v32.94,8.83 33.32,9.21 36.81,9.21 v36.82,9.2 | v11.68,15.16 11.19,15.16 10.79,14.76 6.35,14.76 5.06,16.06 SPI.2
PC4_D1_TX1  (via drill 0.35)
  Top 0.254: U1.16 16.38,11.51 v16.38,11.43 | v55.56,20.64 56.4,19.8 56.4,16.45 55.38,15.44 50.91,15.44 48.03,12.56 v44.13,12.56
  Bottom 0.254: J3.2 53.66,22.54 v55.56,20.64 | v44.13,12.56 44.07,12.62 29.11,12.62 28.26,11.77 28.26,10.24 27.43,9.41 20.75,9.41 18.73,11.43 v16.38,11.43
PC5_D0_RX1  (via drill 0.35)
  Top 0.254: v15.19,9.45 15.51,9.45 17.04,10.98 17.04,11.45 U1.17 | v56.83,20.67 56.83,16.28 55.56,15.01 51.09,15.01 47.76,11.68 v46.59,11.68
  Bottom 0.254: J3.1 56.2,21.3 v56.83,20.67 | v46.59,11.68 46.43,11.84 43.41,11.84 43.06,12.19 29.29,12.19 28.69,11.59 28.69,10.04 27.62,8.98 20.57,8.98 18.76,10.79 16.68,10.79 16.66,10.77 16.51,10.77 v15.19,9.45
PC6_D4  (via drill 0.35)
  Top 0.203: 34.48,13.85 34.46,13.82 33.46,13.82 33.26,13.62 33.26,13.41 | v19.73,5.55 19.98,5.8 19.98,8.11 20.66,8.78
  Top 0.254: U1.18 18.37,12.06 20.06,12.06 20.58,11.54 20.58,10.49 21.17,9.9 21.17,9.29 20.66,8.78 | v50.78,19.07 50.78,16.8 48.26,14.29 44.17,14.29 v44.13,14.33 | v34.75,14.11 34.48,13.85 | 33.26,13.41 33.26,11.09 32.52,10.35 32.14,10.35 v31.92,10.58
  Bottom 0.254: J3.5 50.78,19.39 v50.78,19.07 | v44.13,14.33 43.81,14.33 43.46,13.97 34.9,13.97 v34.75,14.11 | v31.92,10.58 30.3,8.96 30.3,5.72 29.24,4.67 20.69,4.67 19.81,5.55 v19.73,5.55
PD0_A0
  Top 0.254: J2.5 20.64,1.43 19.95,2.11 19.95,2.42 19.28,3.1 16.59,3.1 15.84,3.85 15.84,4.68 14.97,5.55 14.97,8.3 17.04,10.37 18.12,10.37 U1.20
PD1_A1
  Top 0.254: J2.6 22.4,1.27 21.15,2.52 20.47,2.52 19.46,3.53 16.77,3.53 16.27,4.02 16.27,4.86 15.4,5.73 15.4,8.12 17.22,9.94 18.4,9.94 U1.21
PD2_A2
  Top 0.254: J2.7 24.94,1.27 23.26,2.95 20.65,2.95 19.64,3.96 17.19,3.96 16.7,4.45 16.7,5.04 15.83,5.91 15.83,7.94 17.4,9.51 18.69,9.51 U1.22
PD3_A3
  Top 0.254: J2.8 27.48,1.27 26.23,2.52 24.3,2.52 23.44,3.38 20.83,3.38 19.82,4.39 17.36,4.39 17.14,4.62 17.14,5.21 16.26,6.09 16.26,7.76 17.58,9.08 18.98,9.08 U1.23
PD4_A4
  Top 0.254: J2.9 30.02,1.27 28.77,2.52 26.84,2.52 26.41,2.95 24.48,2.95 23.62,3.81 21.01,3.81 19.99,4.83 17.96,4.83 17.61,5.17 17.61,5.35 16.69,6.27 16.69,7.58 17.76,8.64 19.26,8.64 U1.24
PD5_A5
  Top 0.203: 26.91,3.06 26.87,3.06 26.55,3.38
  Top 0.254: 26.55,3.38 24.66,3.38 23.8,4.24 21.19,4.24 20.39,5.04 20.39,7.92 20.66,8.19 20.79,8.19 U1.25 | J2.10 32.56,1.27 31.31,2.52 30.28,2.52 30.2,2.43 29.47,2.43 28.84,3.06 26.91,3.06
PD6_A6
  Top 0.254: U1.26 22.71,9.29 22.71,8.97 22.32,8.58 21.91,8.58 21.19,7.86 LED.A
PD7_A7_AREF  (via drill 0.35)
  Top 0.254: U1.27 23.39,9.34 C11.1 C12.1 22.23,7.51 v22.23,6.75 | v10.32,19.53 10.32,19.8 10.61,20.08 10.61,22.09 11.06,22.54 15.88,22.54 17.46,24.13 J3.16 | v8.97,16.43 8.97,14.05 9.78,13.24 11.57,13.24 11.91,12.91 v11.91,10.48
  Bottom 0.254: v11.91,10.48 13.24,10.48 14.92,8.8 15.46,8.8 17.03,10.36 18.58,10.36 20.39,8.55 20.43,8.55 v22.23,6.75 | v10.32,19.53 9.05,18.26 9.05,16.51 v8.97,16.43
PE0_D11  (via drill 0.35)
  Top 0.254: v22.39,12.06 22.56,11.89 22.86,11.89 22.95,11.89 22.99,11.89 U1.30
  Bottom 0.254: J3.12 27.62,23.5 27.62,20.13 28.71,19.04 28.71,18.5 28.33,18.11 27.38,18.11 22.61,13.34 22.61,12.29 v22.39,12.06
PE1_D12  (via drill 0.35)
  Top 0.254: U1.31 24.03,11.5 22.57,12.96 v21.95,12.96
  Bottom 0.254: J3.13 23.62,22.03 23.62,18.34 24.47,17.49 24.47,15.81 21.95,13.29 v21.95,12.96
PE2_D13  (via drill 0.35)
  Top 0.254: U1.32 25,11.31 25,10.7 v25.11,10.6
  Bottom 0.254: J3.14 23.19,18.16 24.04,17.31 24.04,15.99 21.27,13.22 21.27,12.01 20.64,11.38 20.64,10.16 20.96,9.84 24.34,9.84 v25.11,10.6
PE3_D8  (via drill 0.35)
  Top 0.203: 33.68,14.23 33.65,14.2 33.3,14.2 32.89,13.79
  Top 0.254: U1.33 25.44,11.6 25.44,11.2 v26.13,10.51 | v34.53,19.12 34.53,17.36 34.27,17.1 34.27,14.81 33.68,14.23 | 32.89,13.79 32.51,13.41 v31.97,13.41
  Bottom 0.254: v31.97,13.41 31.61,13.05 28.93,13.05 27.67,11.79 27.67,10.26 27.25,9.84 26.8,9.84 v26.13,10.51 | J3.9 35.88,20.47 v34.53,19.12
PF2_D35_A12
  Top 0.254: U4.7 29.71,9.49 29.1,10.09 29.1,10.93 26.73,13.3 U1.36
PF3_D36_A13
  Top 0.203: R13.2 28.5,14.42 28.5,14.55 29.09,15.15 Q1.3
  Top 0.254: R13.2 27.47,13.78 26.46,14.79 26.37,14.79 U1.37
PF4_D6~  (via drill 0.35)
  Top 0.254: U1.38 25.61,15.63 26.02,16.05 26.27,16.05 26.48,15.84 27.82,15.84 28.57,16.59 28.57,16.9 v29.53,17.86 | J3.7 38.65,21.82 35.11,21.82 33.93,20.65 30.31,20.65 v29.53,19.87
  Bottom 0.254: v29.53,19.87 v29.53,17.86
PF5_D3~  (via drill 0.35)
  Top 0.254: U1.39 25.69,16.51 26.89,16.51 26.94,16.46 27.51,16.46 v27.75,16.7 | v51.72,19.14 51.72,16.85 48.31,13.45 v44.13,13.45
  Bottom 0.254: J3.4 51.72,20.99 v51.72,19.14 | v27.75,16.7 27.75,14.48 28.74,13.48 31.11,13.48 31.7,14.07 32.24,14.07 32.87,13.45 v44.13,13.45
PF6_RST  (via drill 0.35)
  Top 0.254: R3.1 25.65,17.18 U1.40 24.15,15.69 23,15.69 v22.74,15.94 | v19.92,11.27 19.92,10.54 20.74,9.73 20.74,9.47 19.34,8.07 v19.34,7.98 19.29,7.94 18.41,7.94 18.27,7.8 RESET.2 | J2.3 14.38,2.45 13.81,2.45 13.34,2.92 v13.34,5.61
  Bottom 0.254: v19.92,11.27 20.8,12.14 20.8,13.36 22.74,15.31 v22.74,15.94 | v13.34,5.61 14.99,7.27 18.3,7.27 19.02,7.98 v19.34,7.98
RED
  Top 0.254: R10.6 40.07,15.71 40.03,15.66 40.03,15.55 39.86,15.39 39,15.39 D1.5
RESETN  (via drill 0.35)
  Top 0.254: U3.11 1.11,14.17 1.43,14.49 v1.43,19.05 1.43,19.08 1.72,19.37 1.72,22.09 2,22.37 2.96,22.37 3.24,22.66 R15.2
  Bottom 0.254: v1.43,19.05 1.43,22.38 3.17,24.13 J3.19
RX_D11  (via drill 0.35)
  Top 0.254: v3.2,17.46 3.85,18.12 v13.21,18.12 | v0.61,17.46 0.6,17.48 0.6,19.42 1.11,19.93 U3.10 1.11,22.7 1.56,23.15 R15.1 | Q3.4 15.21,20.61 v15.47,20.86
  Bottom 0.254: v15.47,20.86 13.21,18.6 v13.21,18.12 | v3.2,17.46 v0.61,17.46
SWCLK  (via drill 0.35)
  Top 0.254: U3.12 2.38,13.49 v2.54,13.65 2.54,17.73 4.26,19.45 4.26,22.15 4.03,22.37 3.74,22.66 R15.3
  Bottom 0.254: J2.2 11.25,3.04 11.25,7.5 5.09,13.65 v2.54,13.65
SWDIO  (via drill 0.35)
  Top 0.254: v3.95,10.33 3.65,10.62 U3.13
  Bottom 0.254: J2.1 10.48,7.66 7.59,10.55 4.16,10.55 v3.95,10.33
TX_D11  (via drill 0.35)
  Top 0.254: U3.9 2.38,18.9 1.96,18.48 1.96,14 1.78,13.82 1.78,10.87 2,10.65 2.76,10.65 2.99,10.87 2.99,13.17 3.2,13.38 3.2,16.53 4.35,17.69 12.71,17.69 12.94,17.46 v13.22,17.19 | Q3.1 14.84,18.23 v14.81,18.23 | v16.11,20.16 16.11,20.58 16.36,20.83 16.36,21.02 R14.1
  Bottom 0.254: v16.11,20.16 14.81,18.86 v14.81,18.23 14.34,18.23 13.3,17.19 v13.22,17.19
UPDI
  Top 0.254: U3.7 U3.6 6.19,23.01 Q2.2 R15.4
UPDI_5V  (via drill 0.35)
  Top 0.203: U1.41 24.07,16.32 23.26,16.32 23,16.58 22.48,16.58 22.04,16.14 21.57,16.14 21.19,15.76 21.19,15.56 20.91,15.28 18.22,15.28 v17.98,15.52
  Top 0.254: U1.41 25.8,18.06 R4.1 | Q2.3 8.88,22.86 v9.21,22.86
  Bottom 0.254: v17.98,15.52 13.96,15.52 12.55,16.92 12.55,21.42 11.43,22.54 9.53,22.54 v9.21,22.86
V_USB  (via drill 0.35)
  Top 0.406: J1.A4B9 6.78,7.85 6.49,7.56 5.86,7.56 v5.74,7.43 | v4.68,3.81 5.25,3.24 6.49,3.24 6.78,2.95 J1.B4A9
  Top 0.508: Z1.5 11.11,4.47 F1.1 11.23,2.95 J1.B4A9
  Bottom 0.61: v5.74,7.43 4.94,7.43 4.29,6.77 4.29,4.21 v4.68,3.81

### Text on the board
bPlace: MOSI / MISO / SCK / GND | Made with <3 by SST Alumni / Assembled in China | ATmega4809 / 16MHz•5V / ESP32 / 240MHz•3.3V